# EasyEDA Pro project CALU_BMS_V1.3.0.0.epro, board PCB3
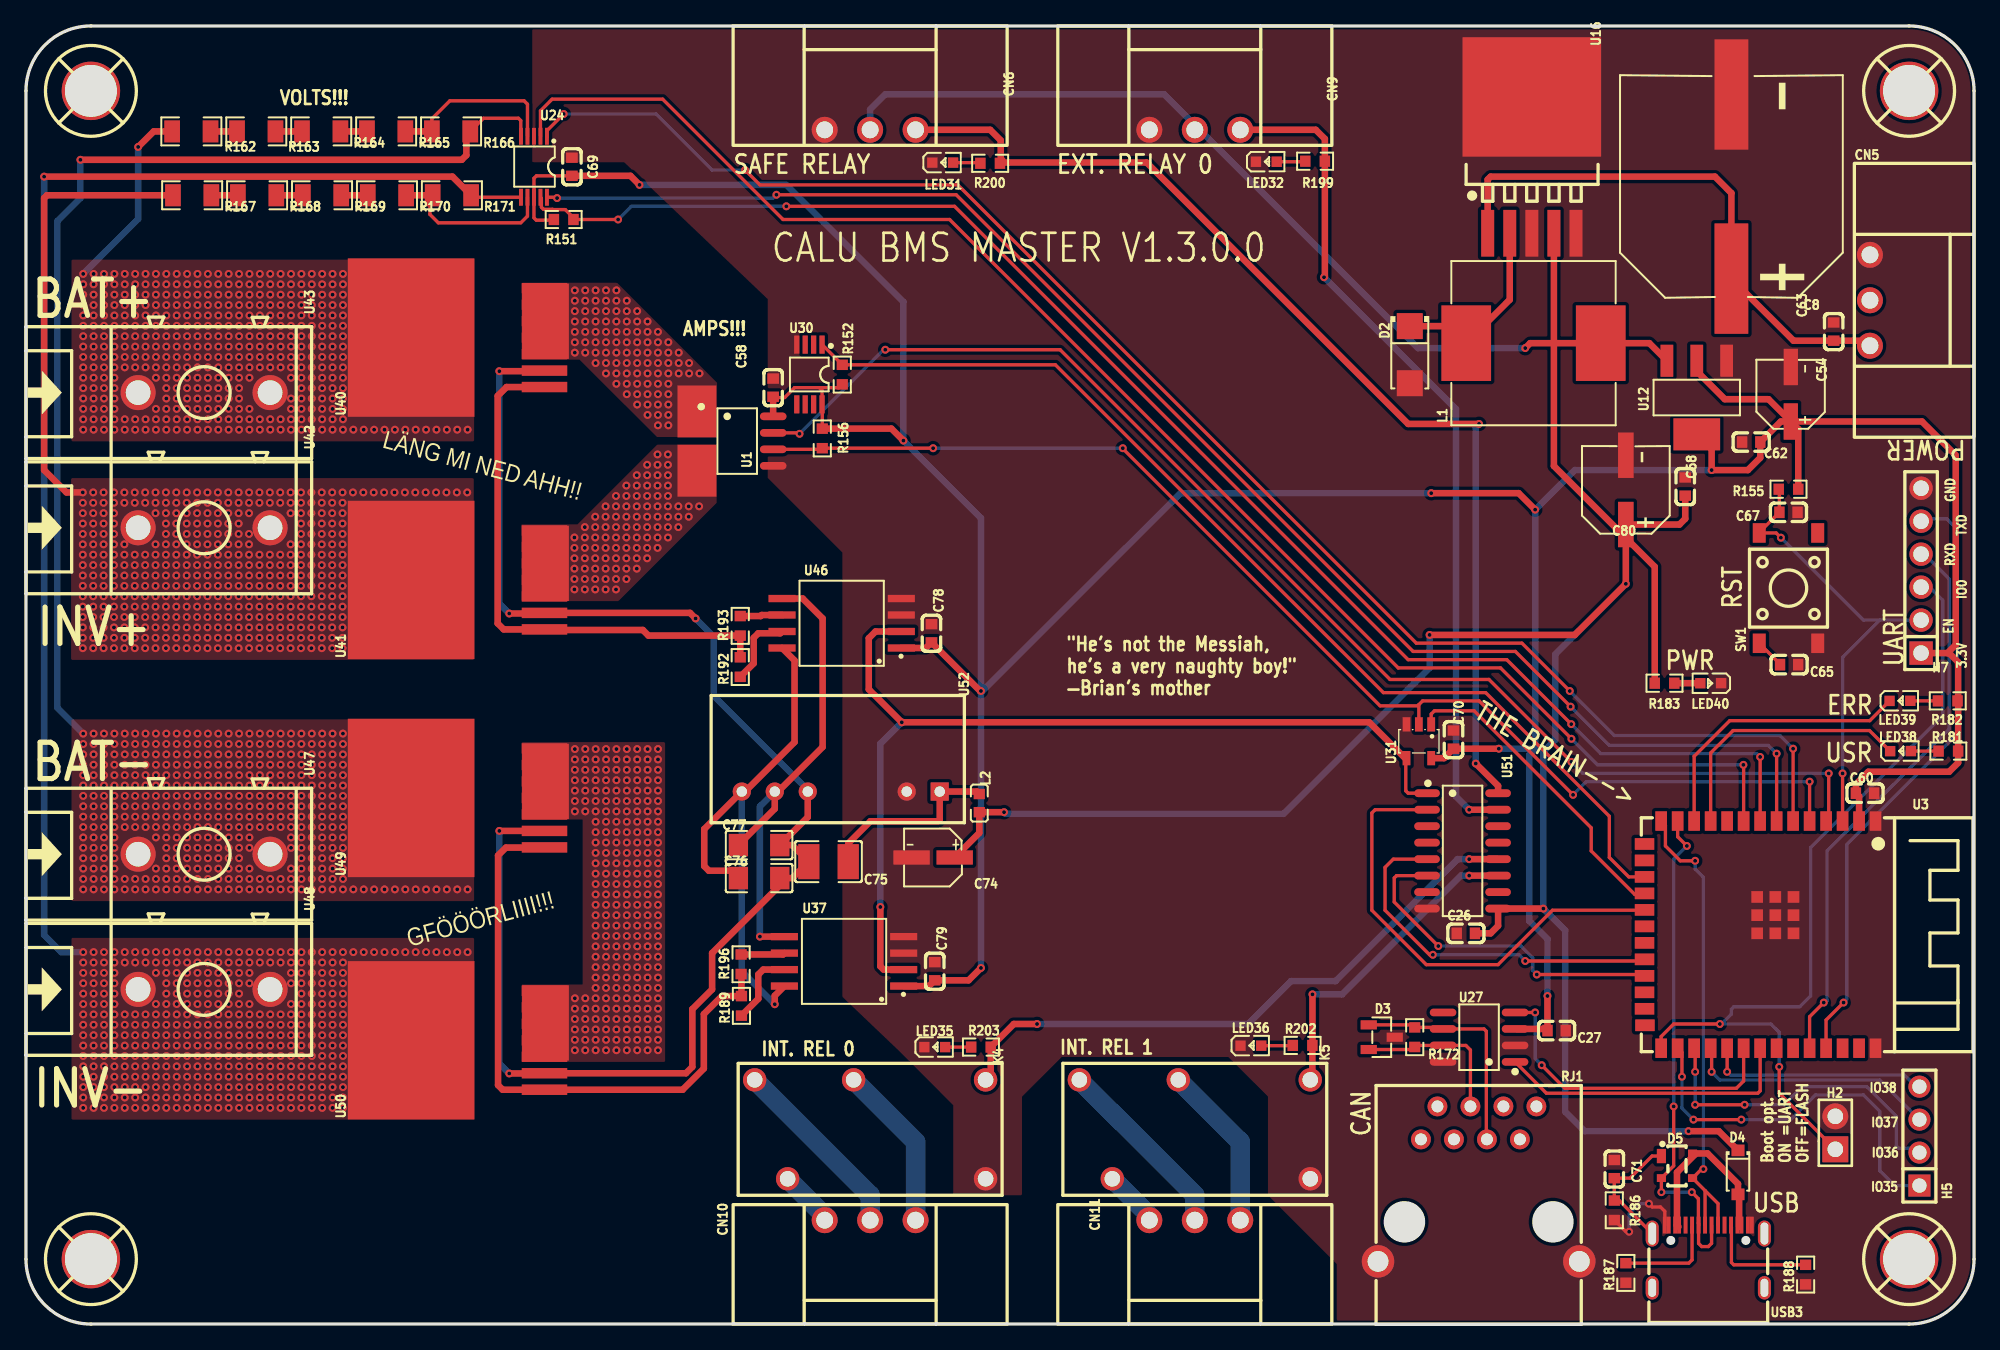
[diagram p17: board, top side]
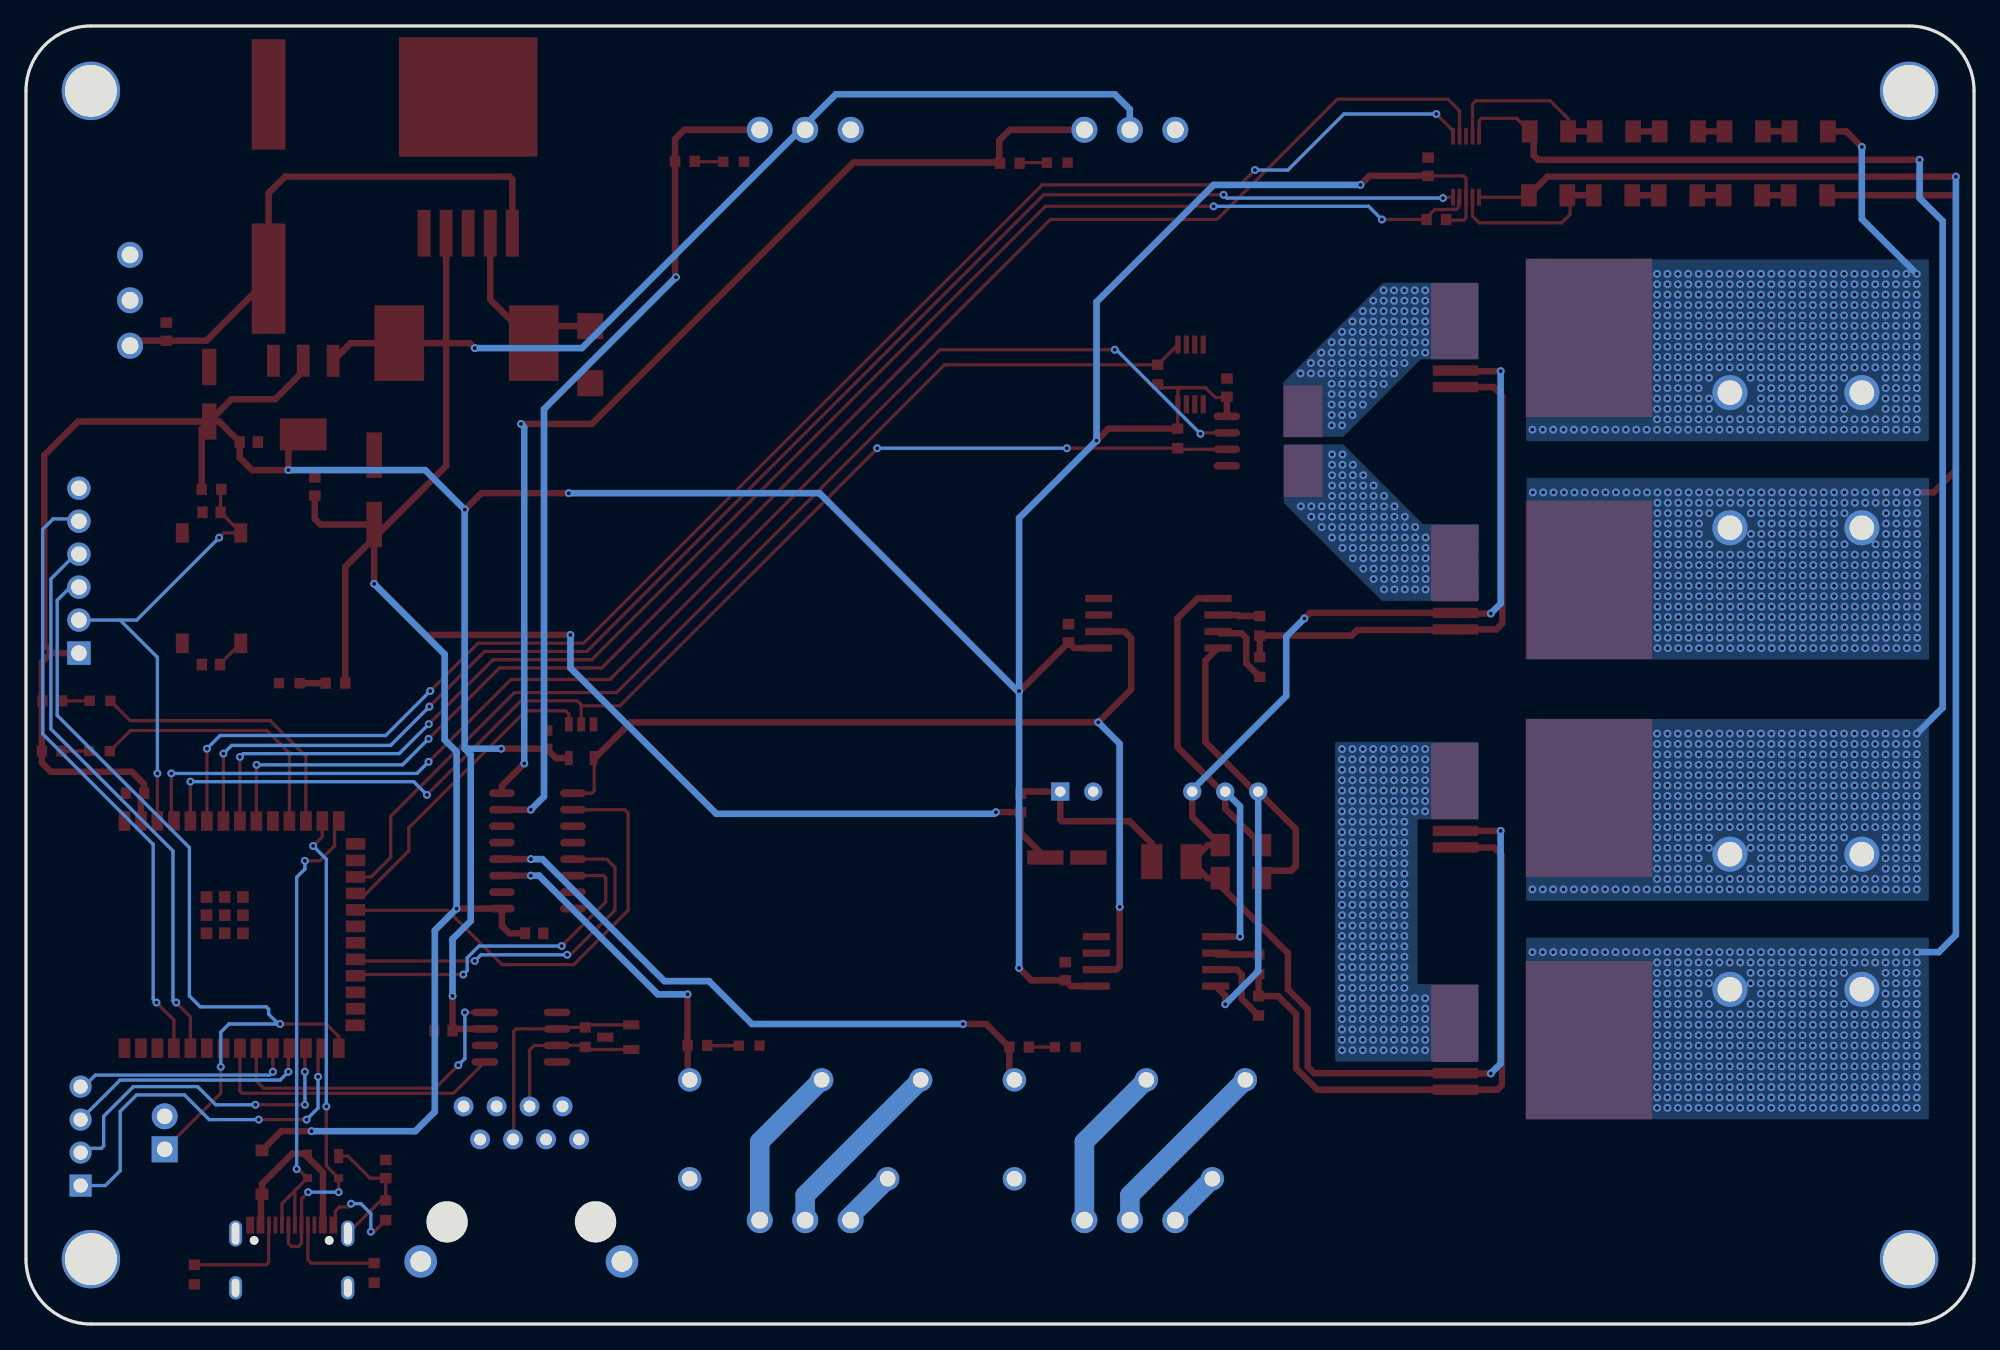
[diagram p18: board, bottom side, seen from below]

Outline 150 x 100 mm; copper layers: Top Layer, Bottom Layer. Coordinates in mm from the lower left corner of the outline.
Outline path: 0,95 0,5 arc(1.46,1.46) 5,0 145,0 arc(148.54,1.46) 150,5 150,95 arc(148.54,98.54) 145,100 5,100 arc(1.46,98.54) 0,95
Stack: Top Layer 0.035mm / Dielectric1 1.51mm FR4 er 4.5 / Bottom Layer 0.035mm

## Design rules (mm)
template: Custom Config
spacing copperThickness1oz (default): track to track 0.102, other pairs 0.152 to 0.3
spacing copperThickness2oz: track to track 0.203, other pairs 0.152 to 0.3
track width copperThickness1oz (default): min 0.127, default 0.254, max 2.54
track width copperThickness2oz: min 0.203, default 0.254, max 2.54
differential pair differentialPair (default): width min 0.127, default 0.254, max 2.54; gap min 0.152, default 0.152
via viaSize (default): diameter min 0.5, default 0.61, max 10; hole min 0.3, default 0.305, max 6.3

## Placement (name value [footprint] x y rotation side)
C8  470uF  [CAP-SMD_BD16.0-L17.0-W17.0-FD-LS18.0]  131.32 87.63 90 top
C26  100nF  [C0603]  110.87 30.1 0 top
C27  100nF  [C0603]  117.86 22.61 180 top
C54  22uF  [CAP-SMD_BD5.0-L5.3-W5.3-LS6.0-FD]  135.89 71.63 90 top
C58  100nF  [C0603]  57.53 72.14 270 top
C60  100nF  [C0603]  141.6 40.89 180 top
C62  100nF  [C0603]  132.84 67.94 0 top
C63  100nF  [C0603]  139.19 76.45 270 top
C65  100nF  [C0603]  135.76 50.8 180 top
C67  1uF  [C0603]  135.71 62.53 180 top
C68  100nF  [C0603]  127.76 64.52 270 top
C69  100nF  [C0603]  42.04 89.15 270 top
C70  100nF  [C0603]  109.92 45.02 270 top
C71  4.7nF  [C0603]  122.3 11.94 90 top
C74  10uF  [CAP-SMD_BD4.0-L4.3-W4.3-FD]  69.85 35.94 180 top
C75  470pF  [C1210]  61.8 35.62 180 top
C76  4.7uF  [C1206]  56.45 34.36 180 top
C77  4.7uF  [C1206]  56.45 36.9 0 top
C78  100nF  [C0603]  69.72 53.21 270 top
C79  100nF  [C0603]  69.98 27.18 270 top
C80  470uF  [CAP-SMD_BD6.3-L6.6-W6.6-LS7.6-RD]  123.19 64.26 90 top
CN5  PWR  [CONN-TH_3P-P3.50_MAX_MX15EDGRM-3.5-GN01-03P-CU-A]  141.99 78.87 90 top
CN6  REL_SAFE  [CONN-TH_3P-P3.50_MAX_MX15EDGRM-3.5-GN01-03P-CU-A]  65 92 180 top
CN9  REL_EXT0  [CONN-TH_3P-P3.50_MAX_MX15EDGRM-3.5-GN01-03P-CU-A]  90 92 180 top
CN10  REL_INT0  [CONN-TH_3P-P3.50_MAX_MX15EDGRM-3.5-GN01-03P-CU-A]  65 8 0 top
CN11  REL_INT1  [CONN-TH_3P-P3.50_MAX_MX15EDGRM-3.5-GN01-03P-CU-A]  90 8 0 top
D2  SS34  [SMA_L4.3-W2.6-LS5.2-RD]  106.55 74.68 270 top
D3  PESD1CAN  [SOT-23-3_L2.9-W1.3-P1.90-LS2.4-BR]  104.39 22.1 180 top
D4  PMEG6020AELRX  [SOD-123_L2.6-W1.7-LS3.5-RD]  131.83 11.68 270 top
D5  PRTR5V0U2X  [SOT-143_L2.9-W1.3-P1.92-LS2.3-BL]  127.13 12.19 270 top
H2  Boot Opt.  [HDR-TH_2P-P2.54-V-M]  139.32 14.73 90 top
H5  IO_B1  [HDR-TH_4P-P2.54-V-M]  145.8 14.48 90 top
H7  PROG  [HDR-TH_6P-P2.54-V-M-1]  145.92 58.04 90 top
K4  G5Q-14 DC5  [RELAY-TH_G5Q-14-DCXX]  65 15 180 top
K5  G5Q-14 DC5  [RELAY-TH_G5Q-14-DCXX]  90 15 180 top
L1  68uH  [IND-SMD_L12.5-W12.5]  116.08 75.56 180 top
L2  10uH  [L0603]  73.41 40.13 90 top
LED31  ORH-B36G  [LED0603-RD]  70.59 89.47 0 top
LED32  ORH-B36G  [LED0603-RD]  95.51 89.54 0 top
LED35  ORH-B36G  [LED0603-RD]  69.98 21.34 0 top
LED36  ORH-B36G  [LED0603-RD]  94.32 21.45 0 top
LED38  LED_USR  [LED0603-RD-YELLOW]  144.34 44.14 0 top
LED39  LED_ERR  [LED0603-RD_RED]  144.29 48.01 0 top
LED40  LED_PWR  [LED0603-RD-YELLOW]  129.72 49.37 180 top
NOREF  -  [Pad_e1168]  51.66 70.31 0 top
NOREF#2  -  [Pad_e226]  40 77.25 0 top
NOREF#3  -  [Pad_e230]  40 41.8 0 top
NOREF#4  -  [Pad_e227]  40 58.6 0 top
NOREF#5  -  [Pad_e1170]  51.66 65.73 0 top
NOREF#6  -  [Pad_e231]  40 23.2 0 top
R151  1kΩ  [R0603]  41.4 85.09 180 top
R152  4.7kΩ  [R0603]  62.86 73.14 270 top
R155  10kΩ  [R0603]  135.71 64.31 0 top
R156  10kΩ  [R0603]  61.32 68.23 90 top
R162  6.8MΩ  [R1206]  12.73 91.88 180 top
R163  6.8MΩ  [R1206]  17.73 91.88 180 top
R164  6.8MΩ  [R1206]  22.73 91.88 180 top
R165  6.8MΩ  [R1206]  27.73 91.88 180 top
R166  100kΩ  [R1206]  32.73 91.88 180 top
R167  6.8MΩ  [R1206]  12.8 86.96 180 top
R168  6.8MΩ  [R1206]  17.8 86.96 180 top
R169  6.8MΩ  [R1206]  22.8 86.96 180 top
R170  6.8MΩ  [R1206]  27.8 86.96 180 top
R171  100kΩ  [R1206]  32.8 86.96 180 top
R172  120Ω  [R0603]  106.93 22.1 270 top
R181  390Ω  [R0603]  148.02 44.14 0 top
R182  820Ω  [R0603]  147.98 48.01 0 top
R183  4.7kΩ  [R0603]  126.17 49.37 180 top
R186  1MΩ  [R0603]  122.3 8.76 90 top
R187  5.1kΩ  [R0603]  123.19 3.94 90 top
R188  5.1kΩ  [R0603]  137.03 3.81 90 top
R189  10Ω  [R0603]  55.09 24.51 90 top
R192  10Ω  [R0603]  55 50.61 90 top
R193  10Ω  [R0603]  55 53.79 270 top
R196  10Ω  [R0603]  55.07 27.72 270 top
R199  2.2kΩ  [R0603]  99.26 89.58 0 top
R200  2.2kΩ  [R0603]  74.24 89.42 0 top
R202  2.2kΩ  [R0603]  98.3 21.46 0 top
R203  2.2kΩ  [R0603]  73.53 21.34 0 top
RJ1  R-RJ45R10P-B000  [RJ45-TH_R-RJ45R10P-B000]  111.86 10.79 180 top
SCREW1  -  [Screw-Hole-M4]  5 5 0 top
SCREW2  -  [Screw-Hole-M4]  145 5 0 top
SCREW3  -  [Screw-Hole-M4]  145 95 0 top
SCREW4  -  [Screw-Hole-M4]  5 95 0 top
SW1  Reboot  [SW-SMD_4P-L6.0-W6.0-P4.50-LS9.0-H2.5]  135.71 56.69 90 top
U1  ACS71240LLCBTR-030B3  [SOIC-8_L4.9-W3.9-P1.27-LS6.0-BL]  54.77 68.02 270 top
U3  ESP32-S3-WROOM-1-N8R8  [WIRELM-SMD_ESP32-S3-WROOM-1]  133.52 30 270 top
U12  AMS1117-3.3  [SOT-223-4_L6.5-W3.5-P2.30-LS7.0-BR]  128.65 71.37 90 top
U16  LM2596HVS-5.0/TR  [TO-263-5_L10.2-W8.9-P1.70-LS15.2-BR]  115.95 89.28 270 top
U24  ADS1118IDGSR  [VSSOP-10_L3.0-W3.0-P0.50-LS4.9-BL]  39.12 89.15 180 top
U27  SN65HVD230DR  [SOIC-8_L4.9-W3.9-P1.27-LS6.0-BL]  111.89 22.1 90 top
U30  DS18B20U(UMW)  [MSOP-8_L3.0-W3.0-P0.65-LS4.9-BL]  60.32 73.15 180 top
U31  SN74AHC1G00DBVR  [SOT-23-5_L3.0-W1.7-P0.95-LS2.8-BR]  107.25 44.89 90 top
U37  1ED3121MU12H  [PG-DSO-8_L7.5-W6.4-P1.27-LS10.3-BL]  62.99 27.94 90 top
U40  SCT040H120G3AG  [H2PAK-7_L10.4-W10.0-P1.27-LS15.0-BL]  34.79 75.99 90 top
U41  SCT040H120G3AG  [H2PAK-7_L10.4-W10.0-P1.27-LS15.0-BL]  34.79 57.32 90 top
U42  INV+  [CONN-TH_JILN_JL136HT-101601G01]  13.72 61.34 270 top
U43  BAT+  [CONN-TH_JILN_JL136HT-101601G01]  13.72 71.75 270 top
U46  1ED3121MU12H  [PG-DSO-8_L7.5-W6.4-P1.27-LS10.3-BL]  62.81 53.99 90 top
U47  BAT-  [CONN-TH_JILN_JL136HT-101601G01]  13.72 36.19 270 top
U48  INV-  [CONN-TH_JILN_JL136HT-101601G01]  13.72 25.78 270 top
U49  SCT040H120G3AG  [H2PAK-7_L10.4-W10.0-P1.27-LS15.0-BL]  34.79 40.53 90 top
U50  SCT040H120G3AG  [H2PAK-7_L10.4-W10.0-P1.27-LS15.0-BL]  34.79 21.86 90 top
U51  ULN2003LVDRG  [SOIC-16_L9.9-W3.9-P1.27-LS6.0-BL]  110.62 36.45 270 top
U52  R05P21509D  [PWRM-TH_5P-L19.5-W9.8_YLPTEC_RXXP2XX]  62.74 41.02 180 top
USB3  TYPE-C 16PIN 2MD(073)  [USB-C-SMD_KH-TYPE-C-16P]  129.54 5.21 0 top

## Footprints (pads in the part's own frame, mm; a bottom-side part is the same pattern mirrored in y, then rotated)
C0603
  rect 0.8x0.9 smd: 1(-0.7,0) 2(0.7,0)
C1206
  rect 1.485x1.728 smd: 1(-1.593,0) 2(1.593,0)
C1210
  rect 1.635x2.7 smd: 1(-1.518,0) 2(1.518,0)
CAP-SMD_BD4.0-L4.3-W4.3-FD
  rect 2.8x1.1 smd: 1(-1.661,0) 2(1.661,0)
CAP-SMD_BD5.0-L5.3-W5.3-LS6.0-FD
  rect 2.8x1.1 smd: 1(-2.1,0) 2(2.1,0)
CAP-SMD_BD6.3-L6.6-W6.6-LS7.6-RD
  rect 3.5x1.2 smd: 1(-2.67,0) 2(2.67,0)
CAP-SMD_BD16.0-L17.0-W17.0-FD-LS18.0
  rect 8.5x2.6 smd: 1(-7.093,0) 2(7.093,0)
CONN-TH_3P-P3.50_MAX_MX15EDGRM-3.5-GN01-03P-CU-A
  round 2 hole 1.3: 1(-3.5,0) 2(0,0) 3(3.5,0)
CONN-TH_JILN_JL136HT-101601G01
  round 2.7 hole 1.9: 1(0,-5.08) 2(0,5.08)
H2PAK-7_L10.4-W10.0-P1.27-LS15.0-BL
  rect 0.8x3.5 smd: 1(-3.81,-5.135) 2(-2.54,-5.135) 3(-1.27,-5.135) 4(0,-5.135) 5(1.27,-5.135) 6(2.54,-5.135) 7(3.81,-5.135)
  rect 12.2x9.75 smd: 8(0,5.135)
HDR-TH_2P-P2.54-V-M
  rect 2x2 hole 1.2: 1(-1.27,0)
  round 2 hole 1.2: 2(1.27,0)
HDR-TH_4P-P2.54-V-M
  rect 1.7x1.7 hole 1.1: 1(-3.81,0)
  round 1.7 hole 1.1: 2(-1.27,0) 3(1.27,0) 4(3.81,0)
HDR-TH_6P-P2.54-V-M-1
  rect 1.8x1.8 hole 1.2: 1(-6.35,0)
  round 1.8 hole 1.2: 2(-3.81,0) 3(-1.27,0) 4(1.27,0) 5(3.81,0) 6(6.35,0)
IND-SMD_L12.5-W12.5
  rect 3.824x5.82 smd: 1(5.178,0) 2(-5.178,0)
L0603
  rect 0.8x0.864 smd: 1(-0.7,0) 2(0.7,0)
LED0603-RD
  rect 0.8x0.8 smd: 1(-0.799,0) 2(0.799,0)
LED0603-RD-YELLOW
  rect 0.8x0.8 smd: 1(-0.799,-0.004) 2(0.799,0.004)
LED0603-RD_RED
  rect 0.8x0.8 smd: 1(-0.799,-0.004) 2(0.799,0.004)
MSOP-8_L3.0-W3.0-P0.65-LS4.9-BL
  rect 0.406x1.397 smd: 1(-0.975,-2.3) 2(-0.325,-2.3) 3(0.325,-2.3) 4(0.975,-2.3) 5(0.975,2.3) 6(0.325,2.3) 7(-0.325,2.3) 8(-0.975,2.3)
Pad_e226
  rect 3.6x5.8 smd: 2(0,0)
Pad_e227
  rect 3.6x5.8 smd: 2(0,0)
Pad_e230
  rect 3.6x5.8 smd: 2(0,0)
Pad_e231
  rect 3.6x5.8 smd: 2(0,0)
Pad_e1168
  rect 3x4 smd: 2(0,0)
Pad_e1170
  rect 3x4 smd: 2(0,0)
PG-DSO-8_L7.5-W6.4-P1.27-LS10.3-BL
  rect 0.56x2.086 smd: 1(-1.905,-4.593) 2(-0.635,-4.593) 3(0.635,-4.593) 4(1.905,-4.593) 5(1.905,4.593) 6(0.635,4.593) 7(-0.635,4.593) 8(-1.905,4.593)
PWRM-TH_5P-L19.5-W9.8_YLPTEC_RXXP2XX
  rect 1.4x1.4 hole 0.8: 1(-7.62,0)
  round 1.4 hole 0.8: 2(-5.08,0) 5(2.54,0) 6(5.08,0) 7(7.62,0)
R0603
  rect 0.806x0.864 smd: 1(-0.753,0) 2(0.753,0)
R1206
  rect 1.208x1.701 smd: 1(-1.479,0) 2(1.479,0)
RELAY-TH_G5Q-14-DCXX
  round 1.8 hole 1.2: 1(-8.89,-3.81) 2(1.27,-3.81) 3(8.89,-3.81) 4(6.35,3.81) 5(-8.89,3.81)
RJ45-TH_R-RJ45R10P-B000
  round 1.524 hole 0.914: 1(4.445,-3.43) 2(3.175,-5.97) 3(1.905,-3.43) 4(0.635,-5.97) 5(-0.635,-3.43) 6(-1.905,-5.97) 7(-3.175,-3.43) 8(-4.445,-5.97)
  round 2.5 hole 1.6: 9(7.75,5.97) 10(-7.75,5.97)
Screw-Hole-M4
  round 4.5 hole 4: 1(0,0)
SMA_L4.3-W2.6-LS5.2-RD
  rect 2x2 smd: 1(-2.2,0) 2(2.2,0)
SOD-123_L2.6-W1.7-LS3.5-RD
  rect 0.9x1 smd: 1(-1.692,0) 2(1.692,0)
SOIC-8_L4.9-W3.9-P1.27-LS6.0-BL
  oval 0.588x2.045 smd: 1(-1.905,-2.772) 2(-0.635,-2.772) 3(0.635,-2.772) 4(1.905,-2.772) 5(1.905,2.772) 6(0.635,2.772) 7(-0.635,2.772) 8(-1.905,2.772)
SOIC-16_L9.9-W3.9-P1.27-LS6.0-BL
  oval 0.602x1.971 smd: 1(-4.445,-2.736) 2(-3.175,-2.736) 3(-1.905,-2.736) 4(-0.635,-2.736) 5(0.635,-2.736) 6(1.905,-2.736) 7(3.175,-2.736) 8(4.445,-2.736) 9(4.445,2.736) 10(3.175,2.736) 11(1.905,2.736) 12(0.635,2.736) 13(-0.635,2.736) 14(-1.905,2.736) 15(-3.175,2.736) 16(-4.445,2.736)
SOT-23-3_L2.9-W1.3-P1.90-LS2.4-BR
  rect 1.25x0.7 smd: 1(1,-0.95) 2(1,0.95) 3(-1,0)
SOT-23-5_L3.0-W1.7-P0.95-LS2.8-BR
  rect 1.1x0.6 smd: 1(1.3,-0.95) 2(1.3,0) 3(1.3,0.95) 4(-1.3,0.95) 5(-1.3,-0.95)
SOT-143_L2.9-W1.3-P1.92-LS2.3-BL
  rect 1.1x0.7 smd: 1(-0.75,-1.2)
  rect 0.6x0.7 smd: 2(0.95,-1.2) 3(0.95,1.2) 4(-0.95,1.2)
SOT-223-4_L6.5-W3.5-P2.30-LS7.0-BR
  rect 2.47x0.98 smd: 1(2.835,-2.3) 2(2.835,0) 3(2.835,2.3)
  rect 2.47x3.6 smd: 4(-2.835,0)
SW-SMD_4P-L6.0-W6.0-P4.50-LS9.0-H2.5
  rect 1.5x1 smd: 1(-4.25,2.25) 2(4.25,2.25) 3(-4.25,-2.25) 4(4.25,-2.25)
TO-263-5_L10.2-W8.9-P1.70-LS15.2-BR
  rect 3.6x1 smd: 1(5.25,-3.4) 2(5.25,-1.7) 3(5.25,0) 4(5.25,1.7) 5(5.25,3.4)
  rect 9.2x10.668 smd: 6(-5.25,0)
USB-C-SMD_KH-TYPE-C-16P
  oval 1x2 hole 0.6x1.7: 1(-4.32,1.765) 2(4.32,1.765)
  oval 1x1.8 hole 0.6x1.4: 3(-4.32,-2.415) 4(4.32,-2.415)
  rect 0.3x1.3 smd: A1(-3.35,2.415) A4(-2.55,2.415) A5(-1.25,2.415) A6(-0.25,2.415) A7(0.25,2.415) A8(1.25,2.415) A9(2.55,2.415) A12(3.35,2.415) B1(3.05,2.415) B4(2.25,2.415) B5(1.75,2.415) B6(0.75,2.415) B7(-0.75,2.415) B8(-1.75,2.415) B9(-2.25,2.415) B12(-3.05,2.415)
VSSOP-10_L3.0-W3.0-P0.50-LS4.9-BL
  rect 0.3x1.3 smd: 1(-1,-2.35) 2(-0.5,-2.35) 3(0,-2.35) 4(0.5,-2.35) 5(1,-2.35) 6(1,2.35) 7(0.5,2.35) 8(0,2.35) 9(-0.5,2.35) 10(-1,2.35)
WIRELM-SMD_ESP32-S3-WROOM-1
  rect 1.5x0.9 smd: 1(-8.75,8.895) 2(-8.75,7.625) 3(-8.75,6.355) 4(-8.75,5.085) 5(-8.75,3.815) 6(-8.75,2.545) 7(-8.75,1.275) 8(-8.75,0.005) 9(-8.75,-1.265) 10(-8.75,-2.535) 11(-8.75,-3.805) 12(-8.75,-5.075) 13(-8.75,-6.345) 14(-8.75,-7.615) 27(8.75,-7.615) 28(8.75,-6.345) 29(8.75,-5.075) 30(8.75,-3.805) 31(8.75,-2.535) 32(8.75,-1.265) 33(8.75,0.005) 34(8.75,1.275) 35(8.75,2.545) 36(8.75,3.815) 37(8.75,5.085) 38(8.75,6.355) 39(8.75,7.625) 40(8.75,8.895)
  rect 0.9x1.5 smd: 15(-6.985,-8.895) 16(-5.715,-8.895) 17(-4.445,-8.895) 18(-3.175,-8.895) 19(-1.905,-8.895) 20(-0.635,-8.895) 21(0.635,-8.895) 22(1.905,-8.895) 23(3.175,-8.895) 24(4.445,-8.895) 25(5.715,-8.895) 26(6.985,-8.865)
  rect 0.9x0.9 smd: 41(-2.9,2.575) 41(-2.9,1.175) 41(-2.9,-0.225) 41(-1.5,2.575) 41(-1.5,1.175) 41(-1.5,-0.225) 41(-0.1,2.575) 41(-0.1,1.175) 41(-0.1,-0.225)

## Nets
As in the schematic, except:
I_BAT+: NOREF.2 NOREF#2.2 U1.1 U1.2 U40.3 U40.4 U40.5 U40.6 U40.7
I_INV+: NOREF#4.2 NOREF#5.2 U1.3 U1.4 U41.3 U41.4 U41.5 U41.6 U41.7
$5N1360: NOREF#3.2 NOREF#6.2 U49.3 U49.4 U49.5 U49.6 U49.7 U50.3 U50.4 U50.5 U50.6 U50.7

Pads without a net: CN5 2; RJ1 1 2 3 6 7 8; SCREW1 1; SCREW2 1; SCREW3 1; SCREW4 1; SW1 4; U3 10 15 16 20 21 24 25 26 34 35 38 39; U27 5; U30 2 3 5 6 7; U51 3 4 7 10 13 14; USB3 2 3 4 A8 B8

## Via types
v1: diameter 0.61, hole 0.305, Top Layer to Bottom Layer, 2111 vias

## Routing (per net, layer and track width the routed paths; a pad name or vN(x,y) marks a point on that pad's centre or on a via; arc(x,y) is an arc through that point)
+5V: length 248.7
  Top Layer w0.5: v1(116.84,32) U51.9 113.35,30.68 112.78,30.1 C26.2 ; C68.2 127.76,62.04 127.32,61.59 C80.1 ; U12.3 125,75.56 L1.2 117.65,75.56 ; v1(75.31,39.43) L2.1 73.41,37.84 C74.1 ; 117.65,75.56 117.65,66.1 123.19,60.56 ; 117.65,75.56 117.65,84.03 ; 117.65,75.56 115.82,75.56 v1(115.44,75.18) ; D4.1 130.34,14.86 v1(128.02,14.86) ; v1(108.08,53.09) 119.25,53.09 v1(123.19,57.02) 123.19,60.56 ; 123.19,60.56 125.41,58.34 125.41,49.37
  Bottom Layer w0.5: v1(108.08,53.09) 108.08,50.55 96.84,39.31 75.44,39.31 v1(75.31,39.43) ; v1(115.44,75.18) 107.19,75.18 90.37,92 CN9.2 90,92.37 87.63,94.74 66.17,94.74 65,93.58 CN6.2 ; v1(123.19,57.02) 117.76,51.59 117.76,45.01 116.84,44.09 v1(116.84,32) 118.52,30.33 118.52,16.36 120.01,14.86 v1(128.02,14.86)
+15V_ISO: length 42.4
  Top Layer w0.5: U46.8 59.18,51.11 59.18,44.83 55.37,41.02 U52.7 52.22,38.13 52.22,35.28 52.58,34.92 54.29,34.92 C76.2 ; U37.8 57.66,25.29 v1(57.66,24.64)
  Bottom Layer w0.5: U52.7 55.12,27.18 v1(57.66,24.64)
-9V_ISO: length 37.6
  Top Layer w0.5: C77.1 57.66,39.7 U52.6 57.91,41.02 61.34,44.45 61.34,54.36 59.81,55.89 U46.5 ; U37.5 v1(56.52,29.84)
  Bottom Layer w0.5: v1(56.52,29.84) 56.52,39.88 U52.6
GND: length 7.3
  Top Layer w0.254: USB3.A1 126.19,8.68 125.86,9.02 125.22,9.02 v1(124.97,9.27) ; R186.1 123.2,7.11 v1(123.44,7.11)
  Bottom Layer w0.254: v1(124.97,9.27) 124.21,9.27 123.44,8.51 v1(123.44,7.11)
GND_ISO: length 118.6
  Top Layer w0.5: v1(37.21,19.3) 39.91,19.3 U50.2 50.82,19.32 51.31,19.81 51.31,24.26 52.83,25.78 52.83,28.57 58.04,33.78 C76.1 59.01,34.36 C75.2 59,36.9 C77.2 60.2,39.05 U52.5 ; v1(51.56,54.36) 51.13,54.78 U41.2 39.88,54.74 v1(37.21,54.74) ; U40.2 39.88,73.41 v1(36.45,73.41) ; U49.2 v1(36.45,37.99)
  Bottom Layer w0.5: v1(36.45,37.99) 36.45,20.07 v1(37.21,19.3) ; v1(51.56,54.36) 52.96,52.96 52.96,48.39 60.2,41.15 U52.5 ; v1(36.45,73.41) 36.45,55.5 v1(37.21,54.74)
VBUS: length 13.6
  Top Layer w0.5: 131.91,9.78 131.91,7.5 ; D4.2 131.83,10.79 129.48,13.14 128.58,13.14 128.58,13.14 127.13,11.68 127.13,7.61 127.24,7.5
VCC: length 316.9
  Top Layer w0.254: R156.2 61.32,70.83 U30.8 61.3,71.92 61.09,72.14 ; 61.09,72.14 59.18,72.14 58.42,71.37 57.59,71.37 C58.2 ; 61.09,72.14 62.6,72.14 R152.2 ; C69.2 39.31,88.45 39.12,88.27 U24.8 39.12,85.22 39.3,85.04 40.6,85.04 R151.2
  Top Layer w0.5: C58.2 57.53,69.93 U1.8 ; 147.96,51.69 148.08,51.69 148.78,51 148.78,47.96 ; 147.96,51.69 148.59,52.32 148.59,66.93 145.99,69.53 C54.1 ; 147.96,51.69 H7.1 ; C54.1 136.47,68.95 R155.2 ; C54.1 135.12,69.53 C62.2 133.54,66.74 132.59,65.79 v1(129.79,65.79) 129.79,67.4 U12.4 ; C54.1 134.17,71.25 130.81,71.25 128.65,73.41 U12.2 ; U31.5 109.19,43.59 C70.2 v1(113.41,44.32) ; U37.1 69.53,26.03 C79.2 72.58,26.48 v1(73.53,27.43) ; U46.1 69.29,52.08 C78.2 73.47,48.77 v1(73.53,48.77) ; C69.2 46.55,88.45 v1(47.24,87.76) ; v1(67.56,68.06) 66.64,68.98 R156.2 ; 117.16,22.73 v1(117.16,25.27) ; 117.16,22.73 C27.2 ; 117.16,22.73 114.79,22.73 ; v1(108.2,64.01) 114.94,64.01 v1(116.21,62.74) ; U3.2 141.15,40.65 C60.2 140.91,41.59 141.86,42.55 148.08,42.55 148.78,43.24 R181.2 148.78,47.96 ; R182.2 148.78,47.96
  Bottom Layer w0.5: 116.22,44.32 116.22,62.75 119.26,65.79 v1(129.79,65.79) ; v1(108.2,64.01) 88.9,64.01 73.53,48.64 v1(73.53,27.43) ; v1(117.16,25.27) 117.16,29.66 115.75,31.06 115.75,43.85 116.22,44.32 v1(113.41,44.32) ; v1(47.24,87.76) 58.55,87.76 67.56,78.74 v1(67.56,68.06) 73.53,62.09 v1(73.53,48.77)
B16+: length 42.9
  Top Layer w0.5: CN5.1 141.6,75.75 C63.2 136.1,75.75 C8.1 131.32,87.12 130.05,88.39 112.78,88.39 112.55,88.17 U16.1
BAT_FAULT: length 24.3
  Top Layer w0.254: U31.1 108.2,46.99 108.46,47.24 111.51,47.24 120.52,38.23 120.52,36.45 123.88,33.09 124.54,33.09 U3.18
CAN_H: length 12.5
  Top Layer w0.254: D3.2 106.74,21.15 R172.2 107.05,21.46 U27.7 110.87,21.46 111.22,21.11 RJ1.4
CAN_L: length 17.6
  Top Layer w0.254: D3.1 106.74,23.05 R172.1 109,22.85 U27.6 112.27,22.73 112.45,22.55 112.45,14.27 RJ1.5
CS: length 120.5
  Top Layer w0.254: v1(119,45.08) 113.54,50.55 105.66,50.55 71.12,85.09 58.29,85.09 49.02,94.36 40.51,94.36 39.62,93.46 U24.2 ; U3.9 132.26,43.06 v1(132.24,43.08)
  Bottom Layer w0.254: v1(132.24,43.08) 121,43.08 v1(119,45.08)
D_REL_EXT0: length 36.3
  Top Layer w0.254: U3.19 124.6,31.88 117.54,31.88 113.35,27.69 107.82,27.69 103.63,31.88 103.63,39.37 103.89,39.62 U51.2
D_REL_INT0: length 28.5
  Top Layer w0.254: v1(115.44,27.97) 124.5,27.97 U3.22 ; U51.5 105.28,35.81 104.65,35.18 104.65,31.88 108.08,28.45 v1(108.33,28.45)
  Bottom Layer w0.254: v1(115.44,27.97) 114.96,28.45 v1(108.33,28.45)
D_REL_INT1: length 26.7
  Top Layer w0.254: v1(108.75,29.12) 105.36,32.51 105.36,34.36 105.54,34.54 U51.6 ; v1(116.33,26.92) 124.53,26.92 U3.23
  Bottom Layer w0.254: v1(108.75,29.12) 115.12,29.12 116.03,28.21 116.03,27.23 v1(116.33,26.92)
D_REL_SAFE: length 75.9
  Top Layer w0.254: U51.1 106.43,40.89 106.25,41.07 106.25,43.54 U31.4
  Top Layer w0.5: U46.2 65.42,53.35 64.9,52.83 64.9,48.89 v1(67.44,46.36) 103.43,46.36 106.25,43.54 ; v1(65.79,32.13) 65.79,27.56 66.04,27.31 U37.2
  Bottom Layer w0.5: v1(67.44,46.36) 65.79,44.7 v1(65.79,32.13)
EN: length 35.9
  Top Layer w0.254: R155.1 135.01,64.26 C67.2 133.46,60.98 SW1.2 134.76,60.94 v1(135.13,60.58) ; U3.3 v1(139.88,42.42)
  Bottom Layer w0.254: 142.75,54.23 141.48,54.23 v1(135.13,60.58) ; 142.75,54.23 H7.2 ; 142.75,54.23 139.88,51.36 v1(139.88,42.42)
I_BAT: length 101.3
  Top Layer w0.254: U3.4 138.81,38.95 v1(138.81,42.42) ; U1.7 59.49,68.66 v1(59.56,68.58) ; v1(119,43.31) 112.65,49.66 105.03,49.66 79.63,75.06 v1(66.17,75.06)
  Bottom Layer w0.254: v1(119,43.31) 119.89,42.42 v1(138.81,42.42) ; v1(66.17,75.06) 66.04,75.06 v1(59.56,68.58)
I_BAT+:
  vias: v1(42.26,79.63) v1(42.26,78.83) v1(42.26,78.03) v1(42.26,77.23) v1(42.26,76.43) v1(42.26,75.63) v1(42.26,74.83) v1(43.06,79.63) v1(43.06,78.83) v1(43.06,78.03) v1(43.06,77.23) v1(43.06,76.43) v1(43.06,75.63) v1(43.06,74.83) v1(43.86,79.63) v1(43.86,78.83) v1(43.86,78.03) v1(43.86,77.23) v1(43.86,76.43) v1(43.86,75.63) v1(43.86,74.83) v1(43.86,74.03) v1(44.66,79.63) v1(44.66,78.83) v1(44.66,78.03) v1(44.66,77.23) v1(44.66,76.43) v1(44.66,75.63) v1(44.66,74.83) v1(44.66,74.03) v1(44.66,73.23) v1(45.46,79.63) v1(45.46,78.83) v1(45.46,78.03) v1(45.46,77.23) v1(45.46,76.43) v1(45.46,75.63) v1(45.46,74.83) v1(45.46,74.03) v1(45.46,73.23) v1(45.46,72.43) v1(46.26,78.83) v1(46.26,78.03) v1(46.26,77.23) v1(46.26,76.43) v1(46.26,75.63) v1(46.26,74.83) v1(46.26,74.03) v1(46.26,73.23) v1(46.26,72.43) v1(46.26,71.63) v1(47.06,78.03) v1(47.06,77.23) v1(47.06,76.43) v1(47.06,75.63) v1(47.06,74.83) v1(47.06,74.03) v1(47.06,73.23) v1(47.06,72.43) v1(47.06,71.63) v1(47.06,70.83) v1(47.86,77.23) v1(47.86,76.43) v1(47.86,75.63) v1(47.86,74.83) v1(47.86,74.03) v1(47.86,73.23) v1(47.86,72.43) v1(47.86,71.63) v1(47.86,70.83) v1(47.86,70.03) v1(48.66,76.43) v1(48.66,75.63) v1(48.66,74.83) v1(48.66,74.03) v1(48.66,73.23) v1(48.66,72.43) v1(48.66,71.63) v1(48.66,70.83) v1(48.66,70.03) v1(48.66,69.23) v1(49.46,75.63) v1(49.46,74.83) v1(49.46,74.03) v1(49.46,73.23) v1(49.46,72.43) v1(49.46,71.63) v1(49.46,70.83) v1(49.46,70.03) v1(49.46,69.23) v1(50.26,74.83) v1(50.26,74.03) v1(50.26,73.23) v1(51.06,74.03) v1(51.06,73.23) v1(51.86,73.23)
I_BAT_FAULT: length 96.3
  Top Layer w0.254: R156.1 v1(69.85,67.47) ; 107.25,47.71 107.16,47.62 104.27,47.62 84.42,67.47 v1(84.46,67.47) ; 107.25,47.71 107.54,48.01 111.89,48.01 v1(119.13,40.77) ; 107.25,47.71 U31.2 ; U1.6 61.38,67.39 ; U3.5 v1(137.34,41.78)
  Bottom Layer w0.254: v1(119.13,40.77) 120.14,41.78 v1(137.34,41.78) ; v1(69.85,67.47) v1(84.46,67.47)
I_INV+:
  vias: v1(42.23,60.59) v1(42.23,59.79) v1(42.23,58.99) v1(42.23,58.19) v1(42.23,57.39) v1(42.23,56.59) v1(43.03,61.39) v1(43.03,60.59) v1(43.03,59.79) v1(43.03,58.99) v1(43.03,58.19) v1(43.03,57.39) v1(43.03,56.59) v1(43.83,62.19) v1(43.83,61.39) v1(43.83,60.59) v1(43.83,59.79) v1(43.83,58.99) v1(43.83,58.19) v1(43.83,57.39) v1(43.83,56.59) v1(44.63,62.99) v1(44.63,62.19) v1(44.63,61.39) v1(44.63,60.59) v1(44.63,59.79) v1(44.63,58.99) v1(44.63,58.19) v1(44.63,57.39) v1(44.63,56.59) v1(45.43,63.79) v1(45.43,62.99) v1(45.43,62.19) v1(45.43,61.39) v1(45.43,60.59) v1(45.43,59.79) v1(45.43,58.99) v1(45.43,58.19) v1(45.43,57.39) v1(45.43,56.59) v1(46.23,64.59) v1(46.23,63.79) v1(46.23,62.99) v1(46.23,62.19) v1(46.23,61.39) v1(46.23,60.59) v1(46.23,59.79) v1(46.23,58.99) v1(46.23,58.19) v1(46.23,57.39) v1(47.03,65.39) v1(47.03,64.59) v1(47.03,63.79) v1(47.03,62.99) v1(47.03,62.19) v1(47.03,61.39) v1(47.03,60.59) v1(47.03,59.79) v1(47.03,58.99) v1(47.03,58.19) v1(47.83,66.19) v1(47.83,65.39) v1(47.83,64.59) v1(47.83,63.79) v1(47.83,62.99) v1(47.83,62.19) v1(47.83,61.39) v1(47.83,60.59) v1(47.83,59.79) v1(47.83,58.99) v1(48.63,66.99) v1(48.63,66.19) v1(48.63,65.39) v1(48.63,64.59) v1(48.63,63.79) v1(48.63,62.99) v1(48.63,62.19) v1(48.63,61.39) v1(48.63,60.59) v1(48.63,59.79) v1(49.43,66.99) v1(49.43,66.19) v1(49.43,65.39) v1(49.43,64.59) v1(49.43,63.79) v1(49.43,62.99) v1(49.43,62.19) v1(49.43,61.39) v1(49.43,60.59) v1(50.23,62.99) v1(50.23,62.19) v1(50.23,61.39) v1(51.03,62.99) v1(51.03,62.19) v1(51.83,62.99)
IO0: length 66.2
  Top Layer w0.254: U3.27 125.91,22.15 126.87,23.11 v1(130.43,23.11) ; H2.1 135,17.78 v1(135,19.81)
  Bottom Layer w0.254: H7.3 146.58,56.77 147.6,55.75 147.6,46.89 137.41,36.7 137.41,25.27 136.58,24.44 131.5,24.44 131.32,24.26 131.32,23.88 130.56,23.11 ; 130.56,23.11 134.37,23.11 135,22.48 v1(135,19.81) ; 130.56,23.11 v1(130.43,23.11)
IO35: length 29.8
  Top Layer w0.254: v1(127.51,19.05) 127.51,20.92 U3.28 ; v1(128.4,15.75) v1(132.08,15.75)
  Bottom Layer w0.254: H5.1 143.89,10.67 142.75,11.81 142.75,16.38 141.48,17.65 137.79,17.65 135.89,15.75 v1(132.08,15.75) ; v1(127.51,19.05) 127.51,16.64 v1(128.4,15.75)
IO36: length 25.7
  Top Layer w0.254: U3.29 128.52,21.18 v1(128.52,19.43) ; v1(128.52,16.89) v1(132.33,16.89)
  Bottom Layer w0.254: H5.2 145.47,13.54 144.2,13.54 144.02,13.72 144.02,16 141.73,18.29 136.78,18.29 135.38,16.89 v1(132.33,16.89) ; v1(128.52,19.43) v1(128.52,16.89)
IO37: length 19.4
  Top Layer w0.254: v1(129.79,19.43) 129.79,21.18 U3.30
  Bottom Layer w0.254: H5.3 142.75,18.8 130.43,18.8 v1(129.79,19.43)
IO38: length 17.1
  Top Layer w0.254: U3.31 v1(130.99,19.43)
  Bottom Layer w0.254: H5.4 145.54,18.29 144.65,19.18 131.24,19.18 v1(130.99,19.43)
LED_ERR: length 21.8
  Top Layer w0.254: U3.12 128.45,43.74 131.19,46.48 141.97,46.48 LED39.1
LED_USR: length 20.4
  Top Layer w0.254: U3.11 129.72,43.99 131.44,45.72 141.95,45.72 LED38.1
MISO: length 118
  Top Layer w0.254: v1(45.59,85.09) R151.1 42.16,85.23 41.53,85.85 40.57,85.85 40.55,85.88 39.85,85.88 39.69,86.04 39.69,86.73 U24.9 ; U3.8 v1(133.53,43.69) ; v1(58.55,86.11) 71.5,86.11 106.43,51.18 114.02,51.18 v1(118.99,46.22)
  Bottom Layer w0.254: v1(45.59,85.09) 46.61,86.11 v1(58.55,86.11) ; v1(133.53,43.69) 133.28,43.94 121.26,43.94 v1(118.99,46.22)
MOSI: length 117.8
  Top Layer w0.254: v1(40.89,86.74) 40.83,86.8 U24.10 ; v1(118.94,47.56) 114.68,51.82 106.81,51.82 71.63,87 v1(57.78,87) ; U3.7 v1(134.8,43.94)
  Bottom Layer w0.254: v1(40.89,86.74) 57.53,86.74 v1(57.78,87) ; v1(118.94,47.56) 121.92,44.58 134.16,44.58 v1(134.8,43.94)
REL_EXT0: length 65.4
  Top Layer w0.5: CN9.1 99.31,92 100.01,91.3 R199.2 100.01,80.71 v1(99.95,80.64) ; U51.15 v1(111.12,39.62)
  Bottom Layer w0.5: v1(111.12,39.62) 110.11,40.64 110.11,70.48 v1(99.95,80.64)
REL_INT0: length 47.8
  Top Layer w0.5: v1(77.85,23.11) 76.06,23.11 R203.2 74.29,19.21 K4.1 ; v1(111.12,35.81) U51.12
  Bottom Layer w0.5: v1(111.12,35.81) 110.24,35.81 100.84,26.42 97.41,26.42 94.11,23.11 v1(77.85,23.11)
REL_INT1: length 24.7
  Top Layer w0.5: K5.1 99.05,18.97 R202.2 99.06,21.47 v1(99.06,25.4) ; U51.11 v1(111.12,34.54)
  Bottom Layer w0.5: v1(99.06,25.4) 101.35,25.4 110.49,34.54 v1(111.12,34.54)
REL_SAFE: length 83.1
  Top Layer w0.5: CN6.1 74.24,92 75.06,91.19 75.06,89.48 ; U51.16 113.35,41.46 v1(111.63,43.18) ; 75.06,89.48 R200.2 ; 75.06,89.48 86.29,89.48 106.43,69.34 v1(111.89,69.34)
  Bottom Layer w0.5: v1(111.63,43.18) 111.63,69.09 v1(111.89,69.34)
RXD: length 43.6
  Top Layer w0.254: v1(138.43,24.76) 137.34,23.67 U3.36
  Bottom Layer w0.254: H7.4 146.18,59.31 148.08,57.4 148.08,45.85 138.68,36.45 138.68,24.89 138.56,24.76 v1(138.43,24.76)
SCLK: length 122.7
  Top Layer w0.254: v1(118.87,48.77) 115.19,52.45 107.06,52.45 71.75,87.76 56.52,87.76 v1(55.37,88.9) ; v1(41.4,93.22) 40.12,91.93 U24.1 ; U3.6 v1(136.07,44.32)
  Bottom Layer w0.254: v1(41.4,93.22) 48.51,93.22 52.83,88.9 v1(55.37,88.9) ; v1(136.07,44.32) 135.05,45.34 122.3,45.34 v1(118.87,48.77)
TEMP_1WIRE: length 82.2
  Top Layer w0.254: U30.1 R152.1 79.27,73.9 104.52,48.64 112.4,48.64 121.92,39.12 121.92,35.94 123.42,34.44 U3.17
TWAI_RX: length 24.9
  Top Layer w0.254: v1(116.21,24) U27.4 ; v1(116.71,19.94) 118.49,18.16 131.7,18.16 132.26,18.72 U3.32
  Bottom Layer w0.254: v1(116.21,24) 116.21,20.45 v1(116.71,19.94)
TWAI_TX: length 23.2
  Top Layer w0.254: U3.33 133.53,17.96 133.35,17.78 117.07,17.78 U27.1
TXD: length 47.4
  Top Layer w0.254: v1(139.95,24.76) 138.61,23.42 U3.37
  Bottom Layer w0.254: v1(139.95,24.76) 140.21,25.02 140.21,36.96 148.72,45.47 148.72,61.21 147.9,62.03 146.36,62.03 146.18,61.85 H7.5
U_BAT: length 13.5
  Top Layer w0.254: U24.4 38.62,93.97 38.35,94.23 32.64,94.23 31.25,92.85 R166.2
  Top Layer w0.5: R165.1 R166.2
U_BAT+: length 14.6
  Top Layer w0.5: v1(8.64,90.68) 9.83,91.88 R162.2
  Bottom Layer w0.5: v1(4.41,80.9) 8.64,85.13 v1(8.64,90.68)
  vias: v1(4.41,80.1) v1(4.41,79.3) v1(4.41,78.5) v1(4.41,77.7) v1(4.41,76.9) v1(4.41,76.1) v1(4.41,75.3) v1(4.41,74.5) v1(4.41,73.7) v1(4.41,72.9) v1(4.41,72.1) v1(4.41,71.3) v1(4.41,70.5) v1(4.41,69.7) v1(4.41,68.9) v1(5.21,80.9) v1(5.21,80.1) v1(5.21,79.3) v1(5.21,78.5) v1(5.21,77.7) v1(5.21,76.9) v1(5.21,76.1) v1(5.21,75.3) v1(5.21,74.5) v1(5.21,73.7) v1(5.21,72.9) v1(5.21,72.1) v1(5.21,71.3) v1(5.21,70.5) v1(5.21,69.7) v1(5.21,68.9) v1(6.01,80.9) v1(6.01,80.1) v1(6.01,79.3) v1(6.01,78.5) v1(6.01,77.7) v1(6.01,76.9) v1(6.01,76.1) v1(6.01,75.3) v1(6.01,74.5) v1(6.01,73.7) v1(6.01,72.9) v1(6.01,72.1) v1(6.01,71.3) v1(6.01,70.5) v1(6.01,69.7) v1(6.01,68.9) v1(6.81,80.9) v1(6.81,80.1) v1(6.81,79.3) v1(6.81,78.5) v1(6.81,77.7) v1(6.81,76.9) v1(6.81,76.1) v1(6.81,75.3) v1(6.81,74.5) v1(6.81,73.7) v1(6.81,72.9) v1(6.81,72.1) v1(6.81,71.3) v1(6.81,70.5) v1(6.81,69.7) v1(6.81,68.9) v1(7.61,80.9) v1(7.61,80.1) v1(7.61,79.3) v1(7.61,78.5) v1(7.61,77.7) v1(7.61,76.9) v1(7.61,76.1) v1(7.61,75.3) v1(7.61,74.5) v1(7.61,73.7) v1(7.61,69.7) v1(7.61,68.9) v1(8.41,80.9) v1(8.41,80.1) v1(8.41,79.3) v1(8.41,78.5) v1(8.41,77.7) v1(8.41,76.9) v1(8.41,76.1) v1(8.41,75.3) v1(8.41,74.5) v1(8.41,73.7) v1(8.41,69.7) v1(8.41,68.9) v1(9.21,80.9) v1(9.21,80.1) v1(9.21,79.3) v1(9.21,78.5) v1(9.21,77.7) v1(9.21,76.9) v1(9.21,76.1) v1(9.21,75.3) v1(9.21,74.5) v1(9.21,73.7) v1(9.21,69.7) v1(9.21,68.9) v1(10.01,80.9) v1(10.01,80.1) v1(10.01,79.3) v1(10.01,78.5) v1(10.01,77.7) v1(10.01,76.9) v1(10.01,76.1) v1(10.01,75.3) v1(10.01,74.5) v1(10.01,73.7) v1(10.01,72.9) v1(10.01,70.5) v1(10.01,69.7) v1(10.01,68.9) v1(10.81,80.9) v1(10.81,80.1) v1(10.81,79.3) v1(10.81,78.5) v1(10.81,77.7) v1(10.81,76.9) v1(10.81,76.1) v1(10.81,75.3) v1(10.81,74.5) v1(10.81,73.7) v1(10.81,72.9) v1(10.81,72.1) v1(10.81,71.3) v1(10.81,70.5) v1(10.81,69.7) v1(10.81,68.9) v1(11.61,80.9) v1(11.61,80.1) v1(11.61,79.3) v1(11.61,78.5) v1(11.61,77.7) v1(11.61,76.9) v1(11.61,76.1) v1(11.61,75.3) v1(11.61,74.5) v1(11.61,73.7) v1(11.61,72.9) v1(11.61,72.1) v1(11.61,71.3) v1(11.61,70.5) v1(11.61,69.7) v1(11.61,68.9) v1(12.41,80.9) v1(12.41,80.1) v1(12.41,79.3) v1(12.41,78.5) v1(12.41,77.7) v1(12.41,76.9) v1(12.41,76.1) v1(12.41,75.3) v1(12.41,74.5) v1(12.41,73.7) v1(12.41,72.9) v1(12.41,72.1) v1(12.41,71.3) v1(12.41,70.5) v1(12.41,69.7) v1(12.41,68.9) v1(13.21,80.9) v1(13.21,80.1) v1(13.21,79.3) v1(13.21,78.5) v1(13.21,77.7) v1(13.21,76.9) v1(13.21,76.1) v1(13.21,75.3) v1(13.21,74.5) v1(13.21,73.7) v1(13.21,72.9) v1(13.21,72.1) v1(13.21,71.3) v1(13.21,70.5) v1(13.21,69.7) v1(13.21,68.9) v1(14.01,80.9) v1(14.01,80.1) v1(14.01,79.3) v1(14.01,78.5) v1(14.01,77.7) v1(14.01,76.9) v1(14.01,76.1) v1(14.01,75.3) v1(14.01,74.5) v1(14.01,73.7) v1(14.01,72.9) v1(14.01,72.1) v1(14.01,71.3) v1(14.01,70.5) v1(14.01,69.7) v1(14.01,68.9) v1(14.81,80.9) v1(14.81,80.1) v1(14.81,79.3) v1(14.81,78.5) v1(14.81,77.7) v1(14.81,76.9) v1(14.81,76.1) v1(14.81,75.3) v1(14.81,74.5) v1(14.81,73.7) v1(14.81,72.9) v1(14.81,72.1) v1(14.81,71.3) v1(14.81,70.5) v1(14.81,69.7) v1(14.81,68.9) v1(15.61,80.9) v1(15.61,80.1) v1(15.61,79.3) v1(15.61,78.5) v1(15.61,77.7) v1(15.61,76.9) v1(15.61,76.1) v1(15.61,75.3) v1(15.61,74.5) v1(15.61,73.7) v1(15.61,72.9) v1(15.61,72.1) v1(15.61,71.3) v1(15.61,70.5) v1(15.61,69.7) v1(15.61,68.9) v1(16.41,80.9) v1(16.41,80.1) v1(16.41,79.3) v1(16.41,78.5) v1(16.41,77.7) v1(16.41,76.9) v1(16.41,76.1) v1(16.41,75.3) v1(16.41,74.5) v1(16.41,73.7) v1(16.41,72.9) v1(16.41,72.1) v1(16.41,71.3) v1(16.41,70.5) v1(16.41,69.7) v1(16.41,68.9) v1(17.21,80.9) v1(17.21,80.1) v1(17.21,79.3) v1(17.21,78.5) v1(17.21,77.7) v1(17.21,76.9) v1(17.21,76.1) v1(17.21,75.3) v1(17.21,74.5) v1(17.21,73.7) v1(17.21,72.9) v1(17.21,70.5) v1(17.21,69.7) v1(17.21,68.9) v1(18.01,80.9) v1(18.01,80.1) v1(18.01,79.3) v1(18.01,78.5) v1(18.01,77.7) v1(18.01,76.9) v1(18.01,76.1) v1(18.01,75.3) v1(18.01,74.5) v1(18.01,73.7) v1(18.01,69.7) v1(18.01,68.9) v1(18.81,80.9) v1(18.81,80.1) v1(18.81,79.3) v1(18.81,78.5) v1(18.81,77.7) v1(18.81,76.9) v1(18.81,76.1) v1(18.81,75.3) v1(18.81,74.5) v1(18.81,73.7) v1(18.81,69.7) v1(18.81,68.9) v1(19.61,80.9) v1(19.61,80.1) v1(19.61,79.3) v1(19.61,78.5) v1(19.61,77.7) v1(19.61,76.9) v1(19.61,76.1) v1(19.61,75.3) v1(19.61,74.5) v1(19.61,73.7) v1(19.61,69.7) v1(19.61,68.9) v1(20.41,80.9) v1(20.41,80.1) v1(20.41,79.3) v1(20.41,78.5) v1(20.41,77.7) v1(20.41,76.9) v1(20.41,76.1) v1(20.41,75.3) v1(20.41,74.5) v1(20.41,73.7) v1(20.41,72.9) v1(20.41,71.3) v1(20.41,70.5) v1(20.41,69.7) v1(20.41,68.9) v1(21.21,80.9) v1(21.21,80.1) v1(21.21,79.3) v1(21.21,78.5) v1(21.21,77.7) v1(21.21,76.9) v1(21.21,76.1) v1(21.21,75.3) v1(21.21,74.5) v1(21.21,73.7) v1(21.21,72.9) v1(21.21,72.1) v1(21.21,71.3) v1(21.21,70.5) v1(21.21,69.7) v1(21.21,68.9) v1(22.01,80.9) v1(22.01,80.1) v1(22.01,79.3) v1(22.01,78.5) v1(22.01,77.7) v1(22.01,76.9) v1(22.01,76.1) v1(22.01,75.3) v1(22.01,74.5) v1(22.01,73.7) v1(22.01,72.9) v1(22.01,72.1) v1(22.01,71.3) v1(22.01,70.5) v1(22.01,69.7) v1(22.01,68.9) v1(22.81,80.9) v1(22.81,80.1) v1(22.81,79.3) v1(22.81,78.5) v1(22.81,77.7) v1(22.81,76.9) v1(22.81,76.1) v1(22.81,75.3) v1(22.81,74.5) v1(22.81,73.7) v1(22.81,72.9) v1(22.81,72.1) v1(22.81,71.3) v1(22.81,70.5) v1(22.81,69.7) v1(22.81,68.9) v1(23.61,80.9) v1(23.61,80.1) v1(23.61,79.3) v1(23.61,78.5) v1(23.61,77.7) v1(23.61,76.9) v1(23.61,76.1) v1(23.61,75.3) v1(23.61,74.5) v1(23.61,73.7) v1(23.61,72.9) v1(23.61,72.1) v1(23.61,71.3) v1(23.61,70.5) v1(23.61,69.7) v1(23.61,68.9) v1(24.41,80.9) v1(24.41,80.1) v1(24.41,79.3) v1(24.41,78.5) v1(24.41,77.7) v1(24.41,76.9) v1(24.41,76.1) v1(24.41,75.3) v1(24.41,74.5) v1(24.41,73.7) v1(24.41,72.9) v1(24.41,72.1) v1(24.41,71.3) v1(24.41,70.5) v1(24.41,69.7) v1(24.41,68.9) v1(25.21,68.9) v1(26.01,68.9) v1(26.81,68.9) v1(27.61,68.9) v1(28.41,68.9) v1(29.21,68.9) v1(30.01,68.9) v1(30.81,68.9) v1(31.61,68.9) v1(32.41,68.9) v1(33.21,68.9) v1(34.01,68.9)
U_BAT-: length 83.2
  Top Layer w0.254: U24.5 38.1,91.52 38.1,92.71 37.92,92.89 35.22,92.89 R166.1
  Top Layer w0.5: v1(4.19,89.69) 33.56,89.69 33.91,90.04 33.91,91.57 R166.1
  Bottom Layer w0.5: v1(4.41,45.48) 2.41,47.48 2.41,84.96 4.19,86.74 v1(4.19,89.69)
  vias: v1(4.41,44.69) v1(4.41,43.89) v1(4.41,43.08) v1(4.41,42.28) v1(4.41,41.48) v1(4.41,40.69) v1(4.41,39.89) v1(4.41,39.08) v1(4.41,38.28) v1(4.41,37.48) v1(4.41,36.69) v1(4.41,35.89) v1(4.41,35.08) v1(4.41,34.28) v1(4.41,33.48) v1(5.21,45.48) v1(5.21,44.69) v1(5.21,43.89) v1(5.21,43.08) v1(5.21,42.28) v1(5.21,41.48) v1(5.21,40.69) v1(5.21,39.89) v1(5.21,39.08) v1(5.21,38.28) v1(5.21,37.48) v1(5.21,36.69) v1(5.21,35.89) v1(5.21,35.08) v1(5.21,34.28) v1(5.21,33.48) v1(6.01,45.48) v1(6.01,44.69) v1(6.01,43.89) v1(6.01,43.08) v1(6.01,42.28) v1(6.01,41.48) v1(6.01,40.69) v1(6.01,39.89) v1(6.01,39.08) v1(6.01,38.28) v1(6.01,37.48) v1(6.01,36.69) v1(6.01,35.89) v1(6.01,35.08) v1(6.01,34.28) v1(6.01,33.48) v1(6.81,45.48) v1(6.81,44.69) v1(6.81,43.89) v1(6.81,43.08) v1(6.81,42.28) v1(6.81,41.48) v1(6.81,40.69) v1(6.81,39.89) v1(6.81,39.08) v1(6.81,38.28) v1(6.81,37.48) v1(6.81,36.69) v1(6.81,35.89) v1(6.81,35.08) v1(6.81,34.28) v1(6.81,33.48) v1(7.61,45.48) v1(7.61,44.69) v1(7.61,43.89) v1(7.61,43.08) v1(7.61,42.28) v1(7.61,41.48) v1(7.61,40.69) v1(7.61,39.89) v1(7.61,39.08) v1(7.61,38.28) v1(7.61,34.28) v1(7.61,33.48) v1(8.41,45.48) v1(8.41,44.69) v1(8.41,43.89) v1(8.41,43.08) v1(8.41,42.28) v1(8.41,41.48) v1(8.41,40.69) v1(8.41,39.89) v1(8.41,39.08) v1(8.41,38.28) v1(8.41,34.28) v1(8.41,33.48) v1(9.21,45.48) v1(9.21,44.69) v1(9.21,43.89) v1(9.21,43.08) v1(9.21,42.28) v1(9.21,41.48) v1(9.21,40.69) v1(9.21,39.89) v1(9.21,39.08) v1(9.21,38.28) v1(9.21,34.28) v1(9.21,33.48) v1(10.01,45.48) v1(10.01,44.69) v1(10.01,43.89) v1(10.01,43.08) v1(10.01,42.28) v1(10.01,41.48) v1(10.01,40.69) v1(10.01,39.89) v1(10.01,39.08) v1(10.01,38.28) v1(10.01,37.48) v1(10.01,35.08) v1(10.01,34.28) v1(10.01,33.48) v1(10.81,45.48) v1(10.81,44.69) v1(10.81,43.89) v1(10.81,43.08) v1(10.81,42.28) v1(10.81,41.48) v1(10.81,40.69) v1(10.81,39.89) v1(10.81,39.08) v1(10.81,38.28) v1(10.81,37.48) v1(10.81,36.69) v1(10.81,35.89) v1(10.81,35.08) v1(10.81,34.28) v1(10.81,33.48) v1(11.61,45.48) v1(11.61,44.69) v1(11.61,43.89) v1(11.61,43.08) v1(11.61,42.28) v1(11.61,41.48) v1(11.61,40.69) v1(11.61,39.89) v1(11.61,39.08) v1(11.61,38.28) v1(11.61,37.48) v1(11.61,36.69) v1(11.61,35.89) v1(11.61,35.08) v1(11.61,34.28) v1(11.61,33.48) v1(12.41,45.48) v1(12.41,44.69) v1(12.41,43.89) v1(12.41,43.08) v1(12.41,42.28) v1(12.41,41.48) v1(12.41,40.69) v1(12.41,39.89) v1(12.41,39.08) v1(12.41,38.28) v1(12.41,37.48) v1(12.41,36.69) v1(12.41,35.89) v1(12.41,35.08) v1(12.41,34.28) v1(12.41,33.48) v1(13.21,45.48) v1(13.21,44.69) v1(13.21,43.89) v1(13.21,43.08) v1(13.21,42.28) v1(13.21,41.48) v1(13.21,40.69) v1(13.21,39.89) v1(13.21,39.08) v1(13.21,38.28) v1(13.21,37.48) v1(13.21,36.69) v1(13.21,35.89) v1(13.21,35.08) v1(13.21,34.28) v1(13.21,33.48) v1(14.01,45.48) v1(14.01,44.69) v1(14.01,43.89) v1(14.01,43.08) v1(14.01,42.28) v1(14.01,41.48) v1(14.01,40.69) v1(14.01,39.89) v1(14.01,39.08) v1(14.01,38.28) v1(14.01,37.48) v1(14.01,36.69) v1(14.01,35.89) v1(14.01,35.08) v1(14.01,34.28) v1(14.01,33.48) v1(14.81,45.48) v1(14.81,44.69) v1(14.81,43.89) v1(14.81,43.08) v1(14.81,42.28) v1(14.81,41.48) v1(14.81,40.69) v1(14.81,39.89) v1(14.81,39.08) v1(14.81,38.28) v1(14.81,37.48) v1(14.81,36.69) v1(14.81,35.89) v1(14.81,35.08) v1(14.81,34.28) v1(14.81,33.48) v1(15.61,45.48) v1(15.61,44.69) v1(15.61,43.89) v1(15.61,43.08) v1(15.61,42.28) v1(15.61,41.48) v1(15.61,40.69) v1(15.61,39.89) v1(15.61,39.08) v1(15.61,38.28) v1(15.61,37.48) v1(15.61,36.69) v1(15.61,35.89) v1(15.61,35.08) v1(15.61,34.28) v1(15.61,33.48) v1(16.41,45.48) v1(16.41,44.69) v1(16.41,43.89) v1(16.41,43.08) v1(16.41,42.28) v1(16.41,41.48) v1(16.41,40.69) v1(16.41,39.89) v1(16.41,39.08) v1(16.41,38.28) v1(16.41,37.48) v1(16.41,36.69) v1(16.41,35.89) v1(16.41,35.08) v1(16.41,34.28) v1(16.41,33.48) v1(17.21,45.48) v1(17.21,44.69) v1(17.21,43.89) v1(17.21,43.08) v1(17.21,42.28) v1(17.21,41.48) v1(17.21,40.69) v1(17.21,39.89) v1(17.21,39.08) v1(17.21,38.28) v1(17.21,37.48) v1(17.21,36.69) v1(17.21,35.08) v1(17.21,34.28) v1(17.21,33.48) v1(18.01,45.48) v1(18.01,44.69) v1(18.01,43.89) v1(18.01,43.08) v1(18.01,42.28) v1(18.01,41.48) v1(18.01,40.69) v1(18.01,39.89) v1(18.01,39.08) v1(18.01,38.28) v1(18.01,34.28) v1(18.01,33.48) v1(18.81,45.48) v1(18.81,44.69) v1(18.81,43.89) v1(18.81,43.08) v1(18.81,42.28) v1(18.81,41.48) v1(18.81,40.69) v1(18.81,39.89) v1(18.81,39.08) v1(18.81,38.28) v1(18.81,34.28) v1(18.81,33.48) v1(19.61,45.48) v1(19.61,44.69) v1(19.61,43.89) v1(19.61,43.08) v1(19.61,42.28) v1(19.61,41.48) v1(19.61,40.69) v1(19.61,39.89) v1(19.61,39.08) v1(19.61,38.28) v1(19.61,34.28) v1(19.61,33.48) v1(20.41,45.48) v1(20.41,44.69) v1(20.41,43.89) v1(20.41,43.08) v1(20.41,42.28) v1(20.41,41.48) v1(20.41,40.69) v1(20.41,39.89) v1(20.41,39.08) v1(20.41,38.28) v1(20.41,37.48) v1(20.41,36.69) v1(20.41,35.08) v1(20.41,34.28) v1(20.41,33.48) v1(21.21,45.48) v1(21.21,44.69) v1(21.21,43.89) v1(21.21,43.08) v1(21.21,42.28) v1(21.21,41.48) v1(21.21,40.69) v1(21.21,39.89) v1(21.21,39.08) v1(21.21,38.28) v1(21.21,37.48) v1(21.21,36.69) v1(21.21,35.89) v1(21.21,35.08) v1(21.21,34.28) v1(21.21,33.48) v1(22.01,45.48) v1(22.01,44.69) v1(22.01,43.89) v1(22.01,43.08) v1(22.01,42.28) v1(22.01,41.48) v1(22.01,40.69) v1(22.01,39.89) v1(22.01,39.08) v1(22.01,38.28) v1(22.01,37.48) v1(22.01,36.69) v1(22.01,35.89) v1(22.01,35.08) v1(22.01,34.28) v1(22.01,33.48) v1(22.81,45.48) v1(22.81,44.69) v1(22.81,43.89) v1(22.81,43.08) v1(22.81,42.28) v1(22.81,41.48) v1(22.81,40.69) v1(22.81,39.89) v1(22.81,39.08) v1(22.81,38.28) v1(22.81,37.48) v1(22.81,36.69) v1(22.81,35.89) v1(22.81,35.08) v1(22.81,34.28) v1(22.81,33.48) v1(23.61,45.48) v1(23.61,44.69) v1(23.61,43.89) v1(23.61,43.08) v1(23.61,42.28) v1(23.61,41.48) v1(23.61,40.69) v1(23.61,39.89) v1(23.61,39.08) v1(23.61,38.28) v1(23.61,37.48) v1(23.61,36.69) v1(23.61,35.89) v1(23.61,35.08) v1(23.61,34.28) v1(23.61,33.48) v1(24.41,45.48) v1(24.41,44.69) v1(24.41,43.89) v1(24.41,43.08) v1(24.41,42.28) v1(24.41,41.48) v1(24.41,40.69) v1(24.41,39.89) v1(24.41,39.08) v1(24.41,38.28) v1(24.41,37.48) v1(24.41,36.69) v1(24.41,35.89) v1(24.41,35.08) v1(24.41,34.28) v1(24.41,33.48) v1(25.21,33.48) v1(26.01,33.48) v1(26.81,33.48) v1(27.61,33.48) v1(28.41,33.48) v1(29.21,33.48) v1(30.01,33.48) v1(30.81,33.48) v1(31.61,33.48) v1(32.41,33.48) v1(33.21,33.48) v1(34.01,33.48)
U_INV: length 13
  Top Layer w0.254: 31.1,86.96 31.1,85.48 31.75,84.84 38.1,84.84 38.62,85.35 U24.7
  Top Layer w0.5: R171.2 R170.1
U_INV+: length 34.7
  Top Layer w0.5: R167.2 1.61,86.96 1.4,86.74 1.4,65.79 3.12,64.07 v1(4.38,64.07)
  vias: v1(4.38,63.27) v1(4.38,62.47) v1(4.38,61.67) v1(4.38,60.87) v1(4.38,60.07) v1(4.38,59.27) v1(4.38,58.47) v1(4.38,57.67) v1(4.38,56.87) v1(4.38,56.07) v1(4.38,55.27) v1(4.38,54.47) v1(4.38,53.67) v1(4.38,52.87) v1(4.38,52.07) v1(5.18,64.07) v1(5.18,63.27) v1(5.18,62.47) v1(5.18,61.67) v1(5.18,60.87) v1(5.18,60.07) v1(5.18,59.27) v1(5.18,58.47) v1(5.18,57.67) v1(5.18,56.87) v1(5.18,56.07) v1(5.18,55.27) v1(5.18,54.47) v1(5.18,53.67) v1(5.18,52.87) v1(5.18,52.07) v1(5.98,64.07) v1(5.98,63.27) v1(5.98,62.47) v1(5.98,61.67) v1(5.98,60.87) v1(5.98,60.07) v1(5.98,59.27) v1(5.98,58.47) v1(5.98,57.67) v1(5.98,56.87) v1(5.98,56.07) v1(5.98,55.27) v1(5.98,54.47) v1(5.98,53.67) v1(5.98,52.87) v1(5.98,52.07) v1(6.78,64.07) v1(6.78,63.27) v1(6.78,62.47) v1(6.78,61.67) v1(6.78,60.87) v1(6.78,60.07) v1(6.78,59.27) v1(6.78,58.47) v1(6.78,57.67) v1(6.78,56.87) v1(6.78,56.07) v1(6.78,55.27) v1(6.78,54.47) v1(6.78,53.67) v1(6.78,52.87) v1(6.78,52.07) v1(7.58,64.07) v1(7.58,63.27) v1(7.58,60.07) v1(7.58,59.27) v1(7.58,58.47) v1(7.58,57.67) v1(7.58,56.87) v1(7.58,56.07) v1(7.58,55.27) v1(7.58,54.47) v1(7.58,53.67) v1(7.58,52.87) v1(7.58,52.07) v1(8.38,64.07) v1(8.38,63.27) v1(8.38,59.27) v1(8.38,58.47) v1(8.38,57.67) v1(8.38,56.87) v1(8.38,56.07) v1(8.38,55.27) v1(8.38,54.47) v1(8.38,53.67) v1(8.38,52.87) v1(8.38,52.07) v1(9.18,64.07) v1(9.18,63.27) v1(9.18,59.27) v1(9.18,58.47) v1(9.18,57.67) v1(9.18,56.87) v1(9.18,56.07) v1(9.18,55.27) v1(9.18,54.47) v1(9.18,53.67) v1(9.18,52.87) v1(9.18,52.07) v1(9.98,64.07) v1(9.98,63.27) v1(9.98,62.47) v1(9.98,60.07) v1(9.98,59.27) v1(9.98,58.47) v1(9.98,57.67) v1(9.98,56.87) v1(9.98,56.07) v1(9.98,55.27) v1(9.98,54.47) v1(9.98,53.67) v1(9.98,52.87) v1(9.98,52.07) v1(10.78,64.07) v1(10.78,63.27) v1(10.78,62.47) v1(10.78,61.67) v1(10.78,60.87) v1(10.78,60.07) v1(10.78,59.27) v1(10.78,58.47) v1(10.78,57.67) v1(10.78,56.87) v1(10.78,56.07) v1(10.78,55.27) v1(10.78,54.47) v1(10.78,53.67) v1(10.78,52.87) v1(10.78,52.07) v1(11.58,64.07) v1(11.58,63.27) v1(11.58,62.47) v1(11.58,61.67) v1(11.58,60.87) v1(11.58,60.07) v1(11.58,59.27) v1(11.58,58.47) v1(11.58,57.67) v1(11.58,56.87) v1(11.58,56.07) v1(11.58,55.27) v1(11.58,54.47) v1(11.58,53.67) v1(11.58,52.87) v1(11.58,52.07) v1(12.38,64.07) v1(12.38,63.27) v1(12.38,62.47) v1(12.38,61.67) v1(12.38,60.87) v1(12.38,60.07) v1(12.38,59.27) v1(12.38,58.47) v1(12.38,57.67) v1(12.38,56.87) v1(12.38,56.07) v1(12.38,55.27) v1(12.38,54.47) v1(12.38,53.67) v1(12.38,52.87) v1(12.38,52.07) v1(13.18,64.07) v1(13.18,63.27) v1(13.18,62.47) v1(13.18,61.67) v1(13.18,60.87) v1(13.18,60.07) v1(13.18,59.27) v1(13.18,58.47) v1(13.18,57.67) v1(13.18,56.87) v1(13.18,56.07) v1(13.18,55.27) v1(13.18,54.47) v1(13.18,53.67) v1(13.18,52.87) v1(13.18,52.07) v1(13.98,64.07) v1(13.98,63.27) v1(13.98,62.47) v1(13.98,61.67) v1(13.98,60.87) v1(13.98,60.07) v1(13.98,59.27) v1(13.98,58.47) v1(13.98,57.67) v1(13.98,56.87) v1(13.98,56.07) v1(13.98,55.27) v1(13.98,54.47) v1(13.98,53.67) v1(13.98,52.87) v1(13.98,52.07) v1(14.78,64.07) v1(14.78,63.27) v1(14.78,62.47) v1(14.78,61.67) v1(14.78,60.87) v1(14.78,60.07) v1(14.78,59.27) v1(14.78,58.47) v1(14.78,57.67) v1(14.78,56.87) v1(14.78,56.07) v1(14.78,55.27) v1(14.78,54.47) v1(14.78,53.67) v1(14.78,52.87) v1(14.78,52.07) v1(15.58,64.07) v1(15.58,63.27) v1(15.58,62.47) v1(15.58,61.67) v1(15.58,60.87) v1(15.58,60.07) v1(15.58,59.27) v1(15.58,58.47) v1(15.58,57.67) v1(15.58,56.87) v1(15.58,56.07) v1(15.58,55.27) v1(15.58,54.47) v1(15.58,53.67) v1(15.58,52.87) v1(15.58,52.07) v1(16.38,64.07) v1(16.38,63.27) v1(16.38,62.47) v1(16.38,61.67) v1(16.38,60.87) v1(16.38,60.07) v1(16.38,59.27) v1(16.38,58.47) v1(16.38,57.67) v1(16.38,56.87) v1(16.38,56.07) v1(16.38,55.27) v1(16.38,54.47) v1(16.38,53.67) v1(16.38,52.87) v1(16.38,52.07) v1(17.18,64.07) v1(17.18,63.27) v1(17.18,62.47) v1(17.18,60.87) v1(17.18,60.07) v1(17.18,59.27) v1(17.18,58.47) v1(17.18,57.67) v1(17.18,56.87) v1(17.18,56.07) v1(17.18,55.27) v1(17.18,54.47) v1(17.18,53.67) v1(17.18,52.87) v1(17.18,52.07) v1(17.98,64.07) v1(17.98,63.27) v1(17.98,59.27) v1(17.98,58.47) v1(17.98,57.67) v1(17.98,56.87) v1(17.98,56.07) v1(17.98,55.27) v1(17.98,54.47) v1(17.98,53.67) v1(17.98,52.87) v1(17.98,52.07) v1(18.78,64.07) v1(18.78,63.27) v1(18.78,59.27) v1(18.78,58.47) v1(18.78,57.67) v1(18.78,56.87) v1(18.78,56.07) v1(18.78,55.27) v1(18.78,54.47) v1(18.78,53.67) v1(18.78,52.87) v1(18.78,52.07) v1(19.58,64.07) v1(19.58,63.27) v1(19.58,59.27) v1(19.58,58.47) v1(19.58,57.67) v1(19.58,56.87) v1(19.58,56.07) v1(19.58,55.27) v1(19.58,54.47) v1(19.58,53.67) v1(19.58,52.87) v1(19.58,52.07) v1(20.38,64.07) v1(20.38,63.27) v1(20.38,62.47) v1(20.38,60.07) v1(20.38,59.27) v1(20.38,58.47) v1(20.38,57.67) v1(20.38,56.87) v1(20.38,56.07) v1(20.38,55.27) v1(20.38,54.47) v1(20.38,53.67) v1(20.38,52.87) v1(20.38,52.07) v1(21.18,64.07) v1(21.18,63.27) v1(21.18,62.47) v1(21.18,61.67) v1(21.18,60.87) v1(21.18,60.07) v1(21.18,59.27) v1(21.18,58.47) v1(21.18,57.67) v1(21.18,56.87) v1(21.18,56.07) v1(21.18,55.27) v1(21.18,54.47) v1(21.18,53.67) v1(21.18,52.87) v1(21.18,52.07) v1(21.98,64.07) v1(21.98,63.27) v1(21.98,62.47) v1(21.98,61.67) v1(21.98,60.87) v1(21.98,60.07) v1(21.98,59.27) v1(21.98,58.47) v1(21.98,57.67) v1(21.98,56.87) v1(21.98,56.07) v1(21.98,55.27) v1(21.98,54.47) v1(21.98,53.67) v1(21.98,52.87) v1(21.98,52.07) v1(22.78,64.07) v1(22.78,63.27) v1(22.78,62.47) v1(22.78,61.67) v1(22.78,60.87) v1(22.78,60.07) v1(22.78,59.27) v1(22.78,58.47) v1(22.78,57.67) v1(22.78,56.87) v1(22.78,56.07) v1(22.78,55.27) v1(22.78,54.47) v1(22.78,53.67) v1(22.78,52.87) v1(22.78,52.07) v1(23.58,64.07) v1(23.58,63.27) v1(23.58,62.47) v1(23.58,61.67) v1(23.58,60.87) v1(23.58,60.07) v1(23.58,59.27) v1(23.58,58.47) v1(23.58,57.67) v1(23.58,56.87) v1(23.58,56.07) v1(23.58,55.27) v1(23.58,54.47) v1(23.58,53.67) v1(23.58,52.87) v1(23.58,52.07) v1(24.38,64.07) v1(24.38,63.27) v1(24.38,62.47) v1(24.38,61.67) v1(24.38,60.87) v1(24.38,60.07) v1(24.38,59.27) v1(24.38,58.47) v1(24.38,57.67) v1(24.38,56.87) v1(24.38,56.07) v1(24.38,55.27) v1(24.38,54.47) v1(24.38,53.67) v1(24.38,52.87) v1(24.38,52.07) v1(25.18,64.07) v1(25.98,64.07) v1(26.78,64.07) v1(27.58,64.07) v1(28.38,64.07) v1(29.18,64.07) v1(29.98,64.07) v1(30.78,64.07) v1(31.58,64.07) v1(32.38,64.07) v1(33.18,64.07) v1(33.98,64.07)
U_INV-: length 99.4
  Top Layer w0.254: R171.1 34.43,86.8 U24.6
  Top Layer w0.5: R171.1 32.84,88.39 v1(1.4,88.39)
  Bottom Layer w0.5: v1(4.41,28.65) 2.72,28.65 1.4,29.97 v1(1.4,88.39)
  vias: v1(4.41,27.85) v1(4.41,27.05) v1(4.41,26.25) v1(4.41,25.45) v1(4.41,24.65) v1(4.41,23.85) v1(4.41,23.05) v1(4.41,22.25) v1(4.41,21.45) v1(4.41,20.65) v1(4.41,19.85) v1(4.41,19.05) v1(4.41,18.25) v1(4.41,17.45) v1(4.41,16.65) v1(5.21,28.65) v1(5.21,27.85) v1(5.21,27.05) v1(5.21,26.25) v1(5.21,25.45) v1(5.21,24.65) v1(5.21,23.85) v1(5.21,23.05) v1(5.21,22.25) v1(5.21,21.45) v1(5.21,20.65) v1(5.21,19.85) v1(5.21,19.05) v1(5.21,18.25) v1(5.21,17.45) v1(5.21,16.65) v1(6.01,28.65) v1(6.01,27.85) v1(6.01,27.05) v1(6.01,26.25) v1(6.01,25.45) v1(6.01,24.65) v1(6.01,23.85) v1(6.01,23.05) v1(6.01,22.25) v1(6.01,21.45) v1(6.01,20.65) v1(6.01,19.85) v1(6.01,19.05) v1(6.01,18.25) v1(6.01,17.45) v1(6.01,16.65) v1(6.81,28.65) v1(6.81,27.85) v1(6.81,27.05) v1(6.81,26.25) v1(6.81,25.45) v1(6.81,24.65) v1(6.81,23.85) v1(6.81,23.05) v1(6.81,22.25) v1(6.81,21.45) v1(6.81,20.65) v1(6.81,19.85) v1(6.81,19.05) v1(6.81,18.25) v1(6.81,17.45) v1(6.81,16.65) v1(7.61,28.65) v1(7.61,27.85) v1(7.61,23.85) v1(7.61,23.05) v1(7.61,22.25) v1(7.61,21.45) v1(7.61,20.65) v1(7.61,19.85) v1(7.61,19.05) v1(7.61,18.25) v1(7.61,17.45) v1(7.61,16.65) v1(8.41,28.65) v1(8.41,27.85) v1(8.41,23.85) v1(8.41,23.05) v1(8.41,22.25) v1(8.41,21.45) v1(8.41,20.65) v1(8.41,19.85) v1(8.41,19.05) v1(8.41,18.25) v1(8.41,17.45) v1(8.41,16.65) v1(9.21,28.65) v1(9.21,27.85) v1(9.21,23.85) v1(9.21,23.05) v1(9.21,22.25) v1(9.21,21.45) v1(9.21,20.65) v1(9.21,19.85) v1(9.21,19.05) v1(9.21,18.25) v1(9.21,17.45) v1(9.21,16.65) v1(10.01,28.65) v1(10.01,27.85) v1(10.01,27.05) v1(10.01,24.65) v1(10.01,23.85) v1(10.01,23.05) v1(10.01,22.25) v1(10.01,21.45) v1(10.01,20.65) v1(10.01,19.85) v1(10.01,19.05) v1(10.01,18.25) v1(10.01,17.45) v1(10.01,16.65) v1(10.81,28.65) v1(10.81,27.85) v1(10.81,27.05) v1(10.81,26.25) v1(10.81,25.45) v1(10.81,24.65) v1(10.81,23.85) v1(10.81,23.05) v1(10.81,22.25) v1(10.81,21.45) v1(10.81,20.65) v1(10.81,19.85) v1(10.81,19.05) v1(10.81,18.25) v1(10.81,17.45) v1(10.81,16.65) v1(11.61,28.65) v1(11.61,27.85) v1(11.61,27.05) v1(11.61,26.25) v1(11.61,25.45) v1(11.61,24.65) v1(11.61,23.85) v1(11.61,23.05) v1(11.61,22.25) v1(11.61,21.45) v1(11.61,20.65) v1(11.61,19.85) v1(11.61,19.05) v1(11.61,18.25) v1(11.61,17.45) v1(11.61,16.65) v1(12.41,28.65) v1(12.41,27.85) v1(12.41,27.05) v1(12.41,26.25) v1(12.41,25.45) v1(12.41,24.65) v1(12.41,23.85) v1(12.41,23.05) v1(12.41,22.25) v1(12.41,21.45) v1(12.41,20.65) v1(12.41,19.85) v1(12.41,19.05) v1(12.41,18.25) v1(12.41,17.45) v1(12.41,16.65) v1(13.21,28.65) v1(13.21,27.85) v1(13.21,27.05) v1(13.21,26.25) v1(13.21,25.45) v1(13.21,24.65) v1(13.21,23.85) v1(13.21,23.05) v1(13.21,22.25) v1(13.21,21.45) v1(13.21,20.65) v1(13.21,19.85) v1(13.21,19.05) v1(13.21,18.25) v1(13.21,17.45) v1(13.21,16.65) v1(14.01,28.65) v1(14.01,27.85) v1(14.01,27.05) v1(14.01,26.25) v1(14.01,25.45) v1(14.01,24.65) v1(14.01,23.85) v1(14.01,23.05) v1(14.01,22.25) v1(14.01,21.45) v1(14.01,20.65) v1(14.01,19.85) v1(14.01,19.05) v1(14.01,18.25) v1(14.01,17.45) v1(14.01,16.65) v1(14.81,28.65) v1(14.81,27.85) v1(14.81,27.05) v1(14.81,26.25) v1(14.81,25.45) v1(14.81,24.65) v1(14.81,23.85) v1(14.81,23.05) v1(14.81,22.25) v1(14.81,21.45) v1(14.81,20.65) v1(14.81,19.85) v1(14.81,19.05) v1(14.81,18.25) v1(14.81,17.45) v1(14.81,16.65) v1(15.61,28.65) v1(15.61,27.85) v1(15.61,27.05) v1(15.61,26.25) v1(15.61,25.45) v1(15.61,24.65) v1(15.61,23.85) v1(15.61,23.05) v1(15.61,22.25) v1(15.61,21.45) v1(15.61,20.65) v1(15.61,19.85) v1(15.61,19.05) v1(15.61,18.25) v1(15.61,17.45) v1(15.61,16.65) v1(16.41,28.65) v1(16.41,27.85) v1(16.41,27.05) v1(16.41,26.25) v1(16.41,25.45) v1(16.41,24.65) v1(16.41,23.85) v1(16.41,23.05) v1(16.41,22.25) v1(16.41,21.45) v1(16.41,20.65) v1(16.41,19.85) v1(16.41,19.05) v1(16.41,18.25) v1(16.41,17.45) v1(16.41,16.65) v1(17.21,28.65) v1(17.21,27.85) v1(17.21,27.05) v1(17.21,26.25) v1(17.21,24.65) v1(17.21,23.85) v1(17.21,23.05) v1(17.21,22.25) v1(17.21,21.45) v1(17.21,20.65) v1(17.21,19.85) v1(17.21,19.05) v1(17.21,18.25) v1(17.21,17.45) v1(17.21,16.65) v1(18.01,28.65) v1(18.01,27.85) v1(18.01,23.85) v1(18.01,23.05) v1(18.01,22.25) v1(18.01,21.45) v1(18.01,20.65) v1(18.01,19.85) v1(18.01,19.05) v1(18.01,18.25) v1(18.01,17.45) v1(18.01,16.65) v1(18.81,28.65) v1(18.81,27.85) v1(18.81,23.85) v1(18.81,23.05) v1(18.81,22.25) v1(18.81,21.45) v1(18.81,20.65) v1(18.81,19.85) v1(18.81,19.05) v1(18.81,18.25) v1(18.81,17.45) v1(18.81,16.65) v1(19.61,28.65) v1(19.61,27.85) v1(19.61,23.85) v1(19.61,23.05) v1(19.61,22.25) v1(19.61,21.45) v1(19.61,20.65) v1(19.61,19.85) v1(19.61,19.05) v1(19.61,18.25) v1(19.61,17.45) v1(19.61,16.65) v1(20.41,28.65) v1(20.41,27.85) v1(20.41,27.05) v1(20.41,26.25) v1(20.41,24.65) v1(20.41,23.85) v1(20.41,23.05) v1(20.41,22.25) v1(20.41,21.45) v1(20.41,20.65) v1(20.41,19.85) v1(20.41,19.05) v1(20.41,18.25) v1(20.41,17.45) v1(20.41,16.65) v1(21.21,28.65) v1(21.21,27.85) v1(21.21,27.05) v1(21.21,26.25) v1(21.21,25.45) v1(21.21,24.65) v1(21.21,23.85) v1(21.21,23.05) v1(21.21,22.25) v1(21.21,21.45) v1(21.21,20.65) v1(21.21,19.85) v1(21.21,19.05) v1(21.21,18.25) v1(21.21,17.45) v1(21.21,16.65) v1(22.01,28.65) v1(22.01,27.85) v1(22.01,27.05) v1(22.01,26.25) v1(22.01,25.45) v1(22.01,24.65) v1(22.01,23.85) v1(22.01,23.05) v1(22.01,22.25) v1(22.01,21.45) v1(22.01,20.65) v1(22.01,19.85) v1(22.01,19.05) v1(22.01,18.25) v1(22.01,17.45) v1(22.01,16.65) v1(22.81,28.65) v1(22.81,27.85) v1(22.81,27.05) v1(22.81,26.25) v1(22.81,25.45) v1(22.81,24.65) v1(22.81,23.85) v1(22.81,23.05) v1(22.81,22.25) v1(22.81,21.45) v1(22.81,20.65) v1(22.81,19.85) v1(22.81,19.05) v1(22.81,18.25) v1(22.81,17.45) v1(22.81,16.65) v1(23.61,28.65) v1(23.61,27.85) v1(23.61,27.05) v1(23.61,26.25) v1(23.61,25.45) v1(23.61,24.65) v1(23.61,23.85) v1(23.61,23.05) v1(23.61,22.25) v1(23.61,21.45) v1(23.61,20.65) v1(23.61,19.85) v1(23.61,19.05) v1(23.61,18.25) v1(23.61,17.45) v1(23.61,16.65) v1(24.41,28.65) v1(24.41,27.85) v1(24.41,27.05) v1(24.41,26.25) v1(24.41,25.45) v1(24.41,24.65) v1(24.41,23.85) v1(24.41,23.05) v1(24.41,22.25) v1(24.41,21.45) v1(24.41,20.65) v1(24.41,19.85) v1(24.41,19.05) v1(24.41,18.25) v1(24.41,17.45) v1(24.41,16.65) v1(25.21,28.65) v1(26.01,28.65) v1(26.81,28.65) v1(27.61,28.65) v1(28.41,28.65) v1(29.21,28.65) v1(30.01,28.65) v1(30.81,28.65) v1(31.61,28.65) v1(32.41,28.65) v1(33.21,28.65) v1(34.01,28.65)
